# EAGLE design REV4 (EAGLE 9.2.0)
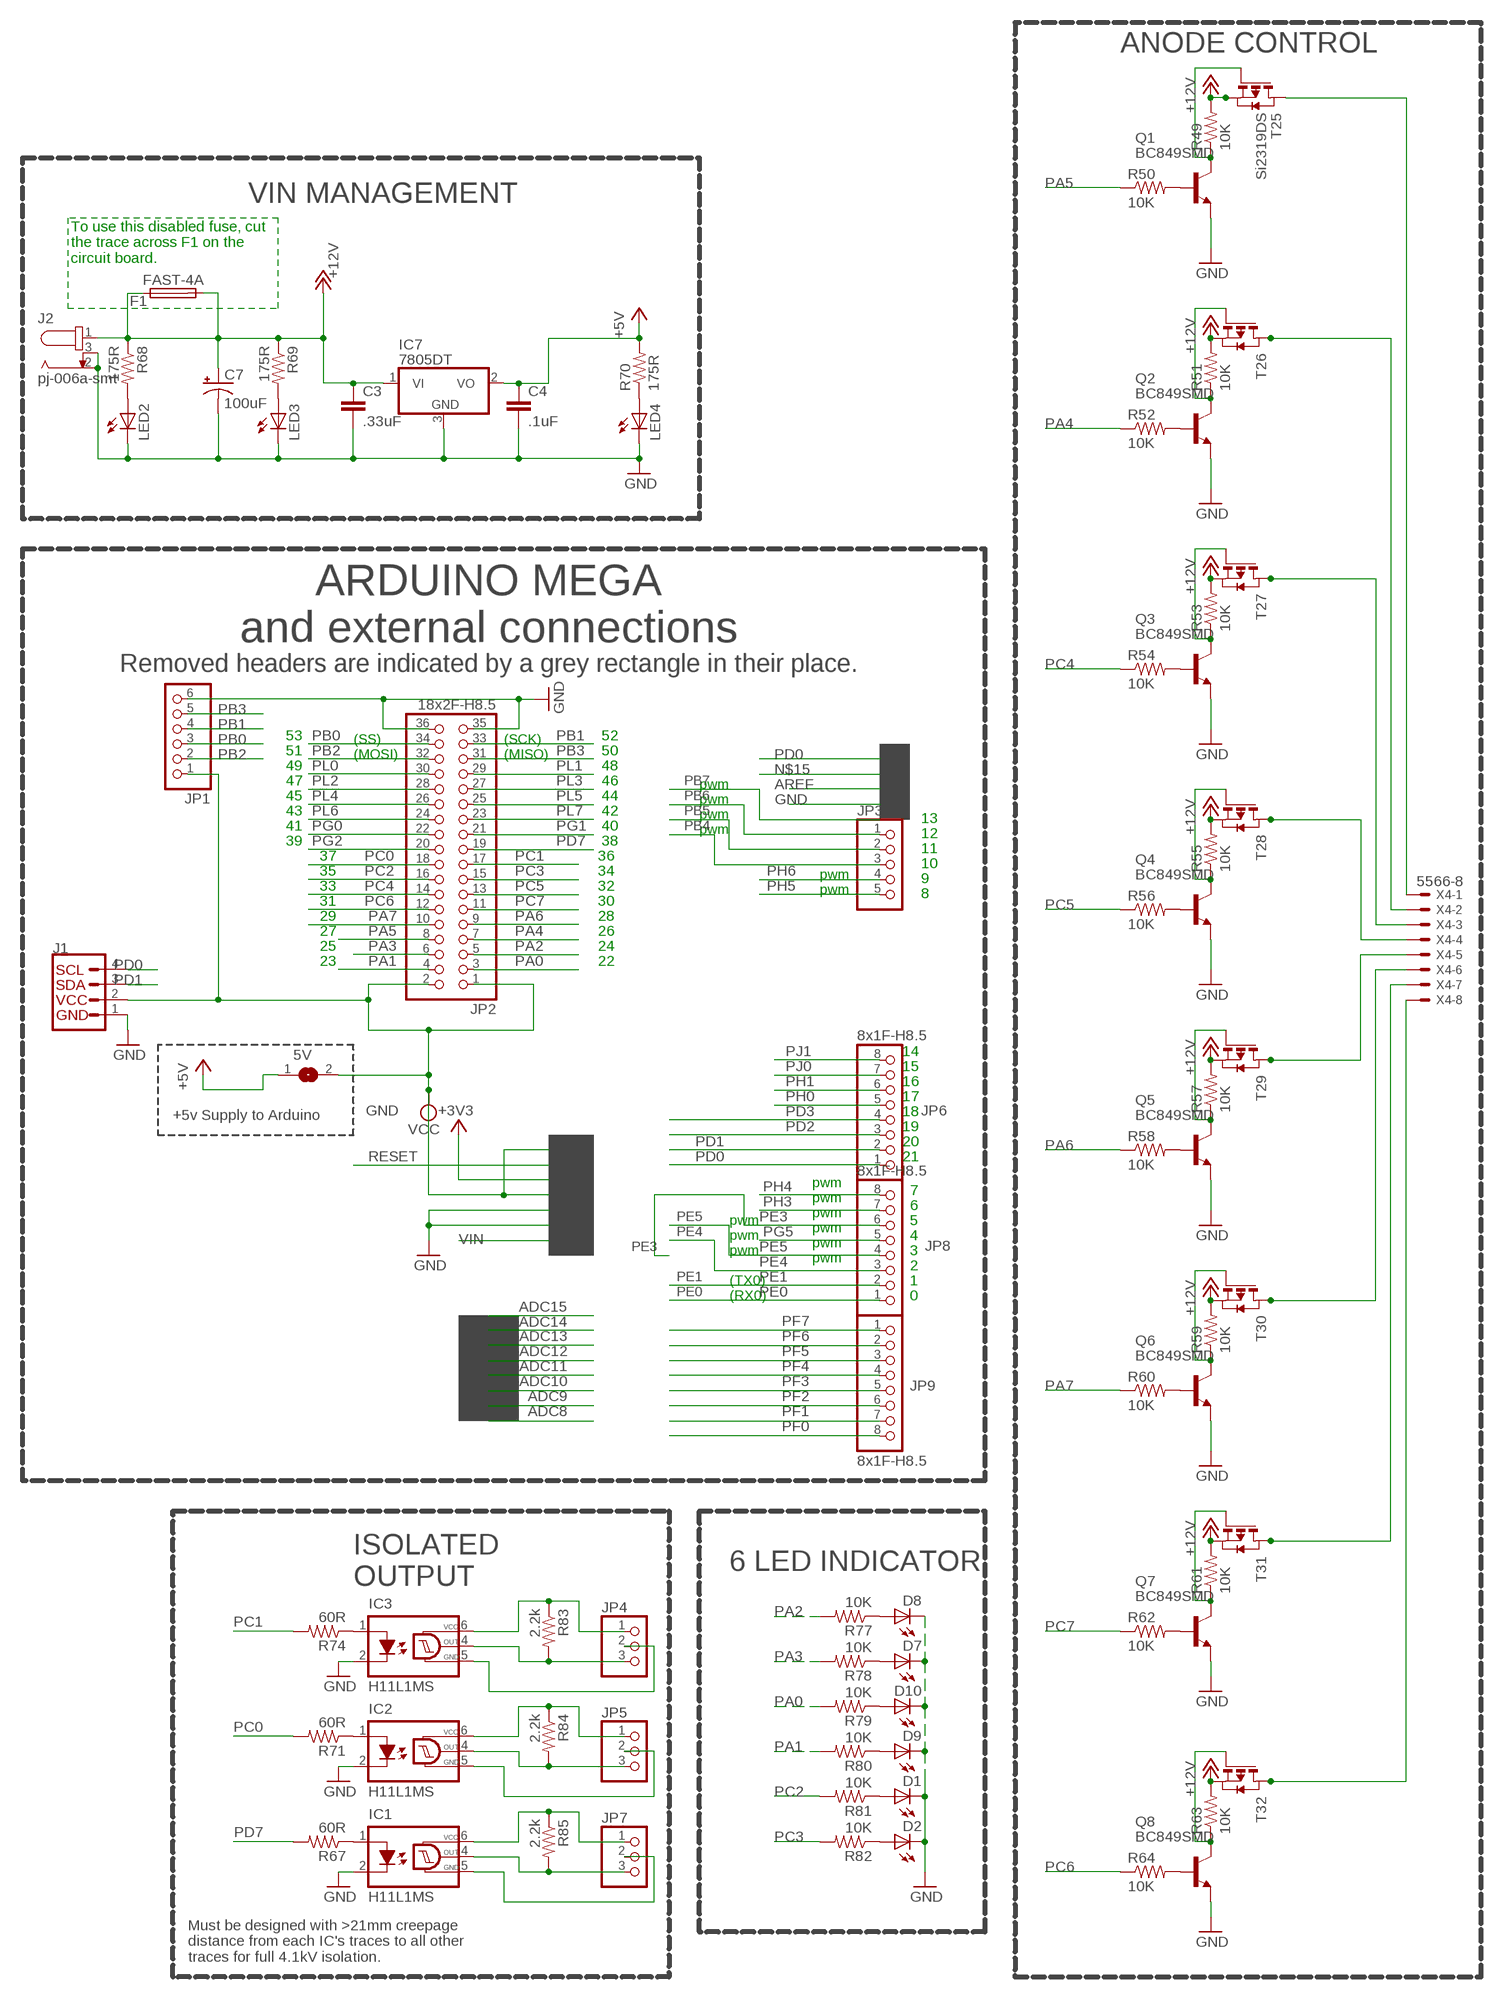
[diagram p0: schematic, sheet 1, part 1 of 2]
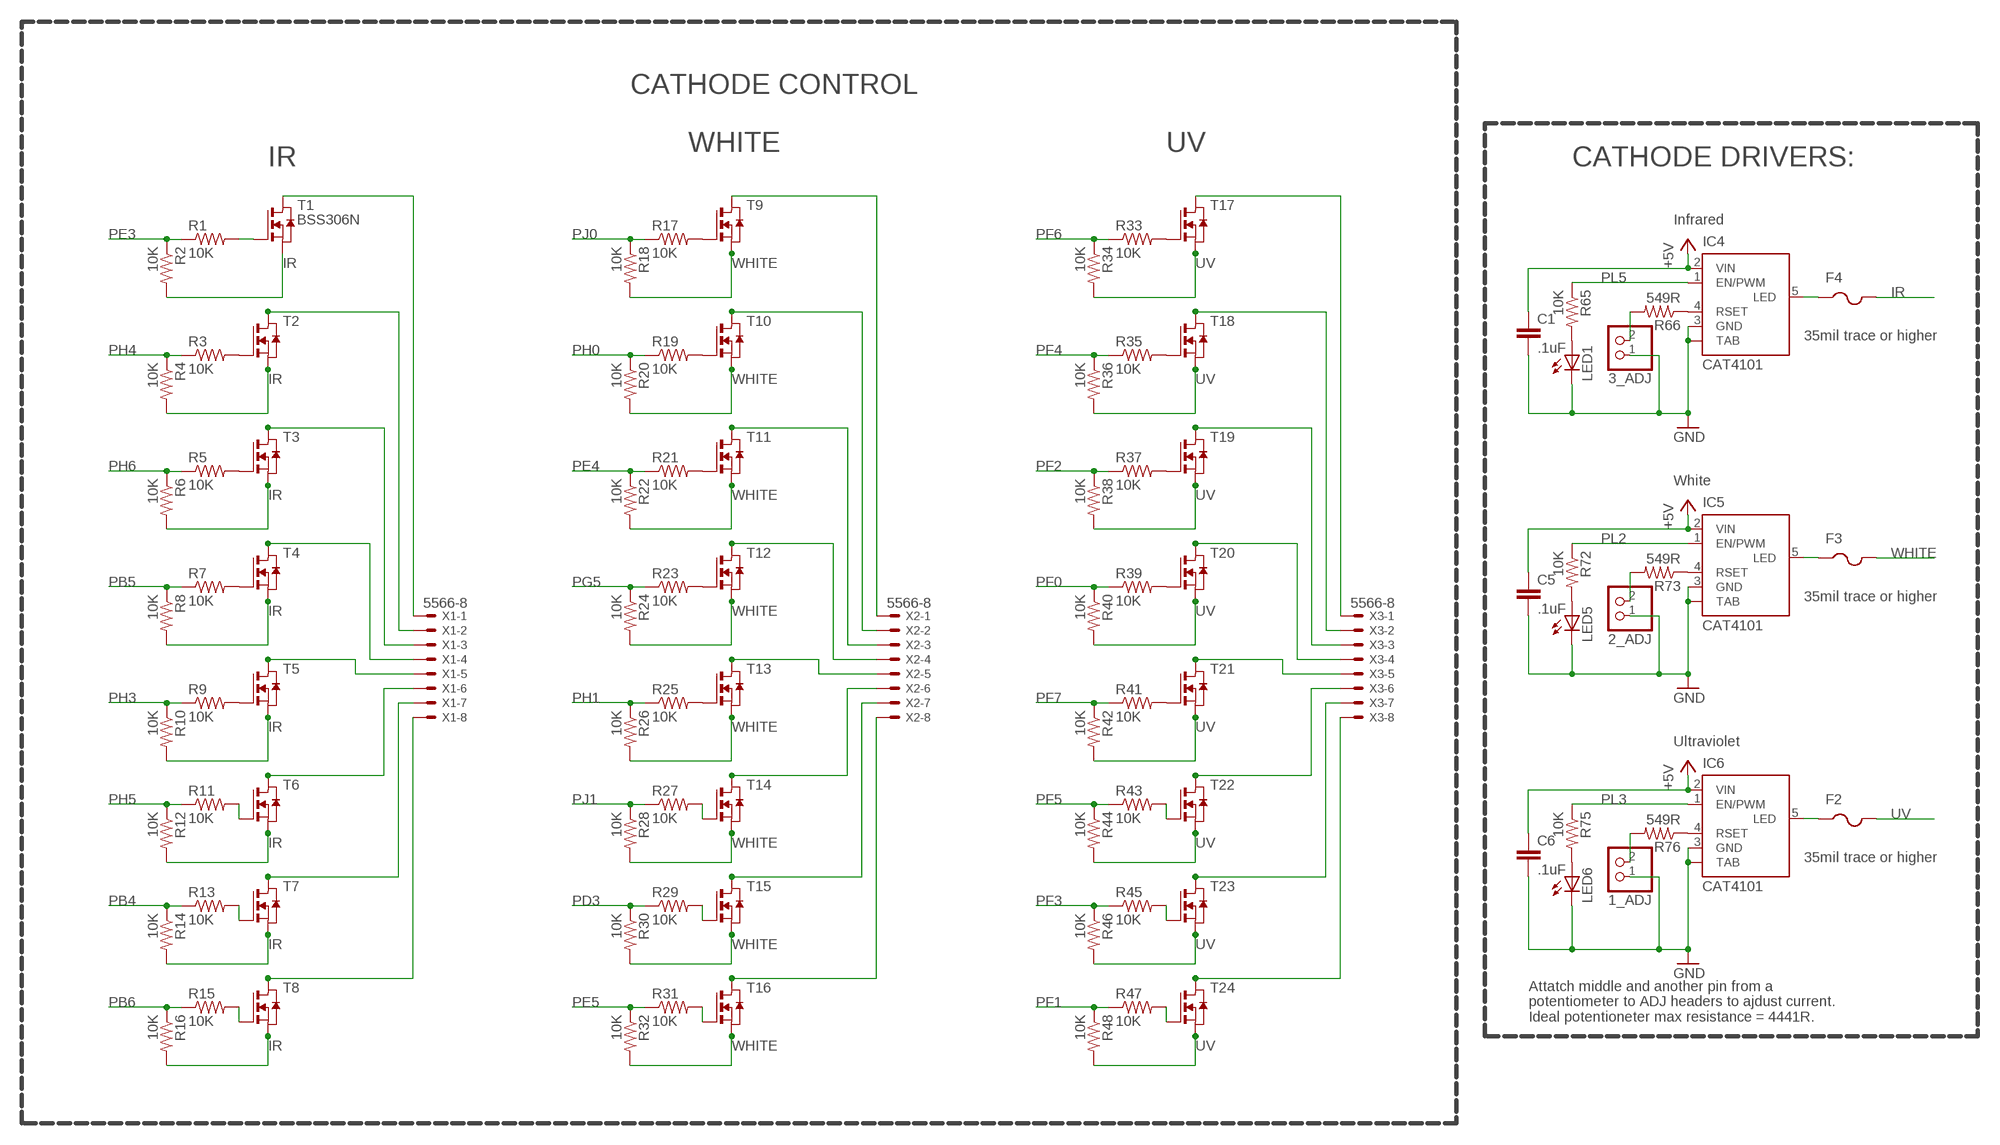
[diagram p1: schematic, sheet 1, part 2 of 2]

## Parts
1_ADJ  PINHD-1X2  [1X02]
2_ADJ  PINHD-1X2  [1X02]
3_ADJ  PINHD-1X2  [1X02]
5V  SJ  [SJ]
C1  .1uF  C  [C0805]
C3  .33uF  C  [C0805]
C4  .1uF  C  [C0805]
C5  .1uF  C  [C0805]
C6  .1uF  C  [C0805]
C7  100uF  CPOL-US153CLV-0807  [153CLV-0807]
D1  LEDSMT1206  [1206]
D2  LEDSMT1206  [1206]
D7  LEDSMT1206  [1206]
D8  LEDSMT1206  [1206]
D9  LEDSMT1206  [1206]
D10  LEDSMT1206  [1206]
F1  FAST-4A  FUSE_MF-SMDF050  [FUSE_MF-SMDF050]
F2  PTCFUSE-1812  [1812]
F3  PTCFUSE-1812  [1812]
F4  PTCFUSE-1812  [1812]
IC1  H11L1MS  [DIL6-SMD]
IC2  H11L1MS  [DIL6-SMD]
IC3  H11L1MS  [DIL6-SMD]
IC4  CAT4101  [TO263_5]
IC5  CAT4101  [TO263_5]
IC6  CAT4101  [TO263_5]
IC7  7805DT  [TO252]
J1  I2C_STANDARD  [1X04]
J2  pj-006a-smt  694106210102  [69410X210102]
JP1  PINHD-1X6  [1X06]
JP2  18x2F-H8.5  PINHD-2X18  [2X18]
JP3  PINHD-1X5  [1X05]
JP4  PINHD-1X3  [1X03]
JP5  PINHD-1X3  [1X03]
JP6  8x1F-H8.5  PINHD-1X8  [1X08]
JP7  PINHD-1X3  [1X03]
JP8  8x1F-H8.5  PINHD-1X8  [1X08]
JP9  8x1F-H8.5  PINHD-1X8  [1X08]
LED1  LEDSMT1206  [1206]
LED2  LEDSMT1206  [1206]
LED3  LEDSMT1206  [1206]
LED4  LEDSMT1206  [1206]
LED5  LEDSMT1206  [1206]
LED6  LEDSMT1206  [1206]
Q1  BC849SMD  [SOT23-BEC]
Q2  BC849SMD  [SOT23-BEC]
Q3  BC849SMD  [SOT23-BEC]
Q4  BC849SMD  [SOT23-BEC]
Q5  BC849SMD  [SOT23-BEC]
Q6  BC849SMD  [SOT23-BEC]
Q7  BC849SMD  [SOT23-BEC]
Q8  BC849SMD  [SOT23-BEC]
R1  10K  R-US_R0805  [R0805]
R2  10K  R-US_R0805  [R0805]
R3  10K  R-US_R0805  [R0805]
R4  10K  R-US_R0805  [R0805]
R5  10K  R-US_R0805  [R0805]
R6  10K  R-US_R0805  [R0805]
R7  10K  R-US_R0805  [R0805]
R8  10K  R-US_R0805  [R0805]
R9  10K  R-US_R0805  [R0805]
R10  10K  R-US_R0805  [R0805]
R11  10K  R-US_R0805  [R0805]
R12  10K  R-US_R0805  [R0805]
R13  10K  R-US_R0805  [R0805]
R14  10K  R-US_R0805  [R0805]
R15  10K  R-US_R0805  [R0805]
R16  10K  R-US_R0805  [R0805]
R17  10K  R-US_R0805  [R0805]
R18  10K  R-US_R0805  [R0805]
R19  10K  R-US_R0805  [R0805]
R20  10K  R-US_R0805  [R0805]
R21  10K  R-US_R0805  [R0805]
R22  10K  R-US_R0805  [R0805]
R23  10K  R-US_R0805  [R0805]
R24  10K  R-US_R0805  [R0805]
R25  10K  R-US_R0805  [R0805]
R26  10K  R-US_R0805  [R0805]
R27  10K  R-US_R0805  [R0805]
R28  10K  R-US_R0805  [R0805]
R29  10K  R-US_R0805  [R0805]
R30  10K  R-US_R0805  [R0805]
R31  10K  R-US_R0805  [R0805]
R32  10K  R-US_R0805  [R0805]
R33  10K  R-US_R0805  [R0805]
R34  10K  R-US_R0805  [R0805]
R35  10K  R-US_R0805  [R0805]
R36  10K  R-US_R0805  [R0805]
R37  10K  R-US_R0805  [R0805]
R38  10K  R-US_R0805  [R0805]
R39  10K  R-US_R0805  [R0805]
R40  10K  R-US_R0805  [R0805]
R41  10K  R-US_R0805  [R0805]
R42  10K  R-US_R0805  [R0805]
R43  10K  R-US_R0805  [R0805]
R44  10K  R-US_R0805  [R0805]
R45  10K  R-US_R0805  [R0805]
R46  10K  R-US_R0805  [R0805]
R47  10K  R-US_R0805  [R0805]
R48  10K  R-US_R0805  [R0805]
R49  10K  R-US_R0805  [R0805]
R50  10K  R-US_R0805  [R0805]
R51  10K  R-US_R0805  [R0805]
R52  10K  R-US_R0805  [R0805]
R53  10K  R-US_R0805  [R0805]
R54  10K  R-US_R0805  [R0805]
R55  10K  R-US_R0805  [R0805]
R56  10K  R-US_R0805  [R0805]
R57  10K  R-US_R0805  [R0805]
R58  10K  R-US_R0805  [R0805]
R59  10K  R-US_R0805  [R0805]
R60  10K  R-US_R0805  [R0805]
R61  10K  R-US_R0805  [R0805]
R62  10K  R-US_R0805  [R0805]
R63  10K  R-US_R0805  [R0805]
R64  10K  R-US_R0805  [R0805]
R65  10K  R-US_R0805  [R0805]
R66  549R  R-US_R0805  [R0805]
R67  60R  R-US_R0805  [R0805]
R68  175R  R-US_R0805  [R0805]
R69  175R  R-US_R0805  [R0805]
R70  175R  R-US_R0805  [R0805]
R71  60R  R-US_R0805  [R0805]
R72  10K  R-US_R0805  [R0805]
R73  549R  R-US_R0805  [R0805]
R74  60R  R-US_R0805  [R0805]
R75  10K  R-US_R0805  [R0805]
R76  549R  R-US_R0805  [R0805]
R77  10K  R-US_R0805  [R0805]
R78  10K  R-US_R0805  [R0805]
R79  10K  R-US_R0805  [R0805]
R80  10K  R-US_R0805  [R0805]
R81  10K  R-US_R0805  [R0805]
R82  10K  R-US_R0805  [R0805]
R83  2.2k  R-US_R0805  [R0805]
R84  2.2k  R-US_R0805  [R0805]
R85  2.2k  R-US_R0805  [R0805]
T1  BSS306N  NMOSSOT23  [SOT-23]
T2  NMOSSOT23  [SOT-23]
T3  NMOSSOT23  [SOT-23]
T4  NMOSSOT23  [SOT-23]
T5  NMOSSOT23  [SOT-23]
T6  NMOSSOT23  [SOT-23]
T7  NMOSSOT23  [SOT-23]
T8  NMOSSOT23  [SOT-23]
T9  NMOSSOT23  [SOT-23]
T10  NMOSSOT23  [SOT-23]
T11  NMOSSOT23  [SOT-23]
T12  NMOSSOT23  [SOT-23]
T13  NMOSSOT23  [SOT-23]
T14  NMOSSOT23  [SOT-23]
T15  NMOSSOT23  [SOT-23]
T16  NMOSSOT23  [SOT-23]
T17  NMOSSOT23  [SOT-23]
T18  NMOSSOT23  [SOT-23]
T19  NMOSSOT23  [SOT-23]
T20  NMOSSOT23  [SOT-23]
T21  NMOSSOT23  [SOT-23]
T22  NMOSSOT23  [SOT-23]
T23  NMOSSOT23  [SOT-23]
T24  NMOSSOT23  [SOT-23]
T25  Si2319DS  PMOSSOT23  [SOT-23]
T26  PMOSSOT23  [SOT-23]
T27  PMOSSOT23  [SOT-23]
T28  PMOSSOT23  [SOT-23]
T29  PMOSSOT23  [SOT-23]
T30  PMOSSOT23  [SOT-23]
T31  PMOSSOT23  [SOT-23]
T32  PMOSSOT23  [SOT-23]
X1  5566-8  [5566-8]
X2  5566-8  [5566-8]
X3  5566-8  [5566-8]
X4  5566-8  [5566-8]

## Nets
+5V [power usb]: 5V.1 C1.1 C4.1 C5.1 C6.1 IC4.2(VIN) IC5.2(VIN) IC6.2(VIN) IC7.2(VO) R70.2
+12V: C3.1 C7.+ F1.1 F1.2 IC7.1(VI) J2.1 R49.2 R51.2 R53.2 R55.2 R57.2 R59.2 R61.2 R63.2 R68.1 R69.1 T25.2(S) T26.2(S) T27.2(S) T28.2(S) T29.2(S) T30.2(S) T31.2(S) T32.2(S)
GND [gnd]: 1_ADJ.1 2_ADJ.1 3_ADJ.1 C1.2 C3.2 C4.2 C5.2 C6.2 C7.- D1.C D2.C D7.C D8.C D9.C D10.C IC1.2(C) IC2.2(C) IC3.2(C) IC4.3(GND) IC4.TAB IC5.3(GND) IC5.TAB IC6.3(GND) IC6.TAB IC7.3(GND) J1.1 J2.2 J2.3 JP1.6 JP2.35 JP2.36 LED1.C LED2.C LED3.C LED4.C LED5.C LED6.C Q1.E Q2.E Q3.E Q4.E Q5.E Q6.E Q7.E Q8.E
IR: F4.2 R2.2 R4.2 R6.2 R8.2 R10.2 R12.2 R14.2 R16.2 T1.2(S) T2.2(S) T3.2(S) T4.2(S) T5.2(S) T6.2(S) T7.2(S) T8.2(S)
N$1: LED4.A R70.1
N$2: Q2.C R51.1 T26.3(G)
N$3: T26.1(D) X4.2
N$4: 1_ADJ.2 R76.2
N$5: Q1.B R50.2
N$6: Q1.C R49.1 T25.3(G)
N$7: T25.1(D) X4.1
N$8: D8.A R77.1
N$9: 2_ADJ.2 R73.2
N$10: LED2.A R68.2
N$11: Q2.B R52.2
N$12: F2.1 IC6.5(LED)
N$13: Q3.C R53.1 T27.3(G)
N$14: D1.A R81.1
N$16: D7.A R78.1
N$17: T27.1(D) X4.3
N$18: D10.A R79.1
N$19: Q3.B R54.2
N$20: F3.1 IC5.5(LED)
N$21: Q4.C R55.1 T28.3(G)
N$22: F4.1 IC4.5(LED)
N$23: T28.1(D) X4.4
N$24: 3_ADJ.2 R66.2
N$25: Q4.B R56.2
N$26: IC4.4(RSET) R66.1
N$27: Q5.C R57.1 T29.3(G)
N$28: IC5.4(RSET) R73.1
N$29: T29.1(D) X4.5
N$30: D2.A R82.1
N$31: Q5.B R58.2
N$33: Q6.C R59.1 T30.3(G)
N$35: T30.1(D) X4.6
N$39: LED3.A R69.2
N$40: LED6.A R75.2
N$41: LED5.A R72.2
N$42: LED1.A R65.2
N$44: R1.2 T1.3(G)
N$45: D9.A R80.1
N$46: IC1.1(A) R67.1
N$47: IC2.1(A) R71.1
N$48: IC3.1(A) R74.1
N$67: Q6.B R60.2
N$78: T1.1(D) X1.1
N$80: R3.2 T2.3(G)
N$81: T2.1(D) X1.2
N$82: R5.2 T3.3(G)
N$83: T3.1(D) X1.3
N$84: R7.2 T4.3(G)
N$85: T4.1(D) X1.4
N$86: R9.2 T5.3(G)
N$87: T5.1(D) X1.5
N$88: R11.2 T6.3(G)
N$89: T6.1(D) X1.6
N$90: R13.2 T7.3(G)
N$91: T7.1(D) X1.7
N$92: R15.2 T8.3(G)
N$93: T8.1(D) X1.8
N$94: R17.2 T9.3(G)
N$95: T9.1(D) X2.1
N$96: R19.2 T10.3(G)
N$97: T10.1(D) X2.2
N$98: R21.2 T11.3(G)
N$99: T11.1(D) X2.3
N$100: R23.2 T12.3(G)
N$101: T12.1(D) X2.4
N$102: R25.2 T13.3(G)
N$103: T13.1(D) X2.5
N$104: R27.2 T14.3(G)
N$105: T14.1(D) X2.6
N$106: R29.2 T15.3(G)
N$107: T15.1(D) X2.7
N$108: R31.2 T16.3(G)
N$109: T16.1(D) X2.8
N$110: R33.2 T17.3(G)
N$111: T17.1(D) X3.1
N$112: R35.2 T18.3(G)
N$113: T18.1(D) X3.2
N$114: R37.2 T19.3(G)
N$115: T19.1(D) X3.3
N$116: R39.2 T20.3(G)
N$117: T20.1(D) X3.4
N$118: R41.2 T21.3(G)
N$119: T21.1(D) X3.5
N$120: R43.2 T22.3(G)
N$121: T22.1(D) X3.6
N$122: R45.2 T23.3(G)
N$123: T23.1(D) X3.7
N$124: R47.2 T24.3(G)
N$125: T24.1(D) X3.8
N$127: Q7.C R61.1 T31.3(G)
N$128: T31.1(D) X4.7
N$129: Q7.B R62.2
N$130: Q8.C R63.1 T32.3(G)
N$131: T32.1(D) X4.8
N$132: Q8.B R64.2
OK6_GND [Isolated]: IC1.5(GND) JP7.2
OK6_OUT [Isolated]: IC1.4(OUT) JP7.3 R85.2
OK6_VCC [Isolated]: IC1.6(VCC) JP7.1 R85.1
OK7_GND [Isolated]: IC2.5(GND) JP5.2
OK7_OUT [Isolated]: IC2.4(OUT) JP5.3 R84.2
OK7_VCC [Isolated]: IC2.6(VCC) JP5.1 R84.1
OK8_GND [Isolated]: IC3.5(GND) JP4.2
OK8_OUT [Isolated]: IC3.4(OUT) JP4.3 R83.2
OK8_VCC [Isolated]: IC3.6(VCC) JP4.1 R83.1
PA0: JP2.3 R79.2
PA1: JP2.4 R80.2
PA2: JP2.5 R77.2
PA3: JP2.6 R78.2
PA4: JP2.7 R52.1
PA5: JP2.8 R50.1
PA6: JP2.9 R58.1
PA7: JP2.10 R60.1
PB0: JP1.3 JP2.34
PB1: JP1.4 JP2.33
PB2: JP1.2 JP2.32
PB3: JP1.5 JP2.31
PB4: JP3.3 R13.1 R14.1
PB5: JP3.2 R7.1 R8.1
PB6: JP3.1 R15.1 R16.1
PC0: JP2.18 R71.2
PC1: JP2.17 R74.2
PC2: JP2.16 R81.2
PC3: JP2.15 R82.2
PC4: JP2.14 R54.1
PC5: JP2.13 R56.1
PC6: JP2.12 R64.1
PC7: JP2.11 R62.1
PD0: J1.4 JP6.1
PD1: J1.3 JP6.2
PD2: JP6.3
PD3: JP6.4 R29.1 R30.1
PD7: JP2.19 R67.2
PE0: JP8.1
PE1: JP8.2
PE3: JP8.6 R1.1 R2.1
PE4: JP8.3 R21.1 R22.1
PE5: JP8.4 R31.1 R32.1
PF0: JP9.8 R39.1 R40.1
PF1: JP9.7 R47.1 R48.1
PF2: JP9.6 R37.1 R38.1
PF3: JP9.5 R45.1 R46.1
PF4: JP9.4 R35.1 R36.1
PF5: JP9.3 R43.1 R44.1
PF6: JP9.2 R33.1 R34.1
PF7: JP9.1 R41.1 R42.1
PG0: JP2.22
PG1: JP2.21
PG2: JP2.20
PG5: JP8.5 R23.1 R24.1
PH0: JP6.5 R19.1 R20.1
PH1: JP6.6 R25.1 R26.1
PH3: JP8.7 R9.1 R10.1
PH4: JP8.8 R3.1 R4.1
PH5: JP3.5 R11.1 R12.1
PH6: JP3.4 R5.1 R6.1
PJ0: JP6.7 R17.1 R18.1
PJ1: JP6.8 R27.1 R28.1
PL0: JP2.30
PL1: JP2.29
PL2: IC5.1(EN/PWM) JP2.28 R72.1
PL3: IC6.1(EN/PWM) JP2.27 R75.1
PL4: JP2.26
PL5: IC4.1(EN/PWM) JP2.25 R65.1
PL6: JP2.24
PL7: JP2.23
UV: F2.2 R34.2 R36.2 R38.2 R40.2 R42.2 R44.2 R46.2 R48.2 T17.2(S) T18.2(S) T19.2(S) T20.2(S) T21.2(S) T22.2(S) T23.2(S) T24.2(S)
UV_SET: IC6.4(RSET) R76.1
VCC: 5V.2 J1.2 JP1.1 JP2.1 JP2.2
WHITE: F3.2 R18.2 R20.2 R22.2 R24.2 R26.2 R28.2 R30.2 R32.2 T9.2(S) T10.2(S) T11.2(S) T12.2(S) T13.2(S) T14.2(S) T15.2(S) T16.2(S)

## Notes on the sheet
- ANODE CONTROL
- VIN MANAGEMENT
- To use this disabled fuse, cut 
  the trace across F1 on the 
  circuit board.
- CATHODE CONTROL
- ARDUINO MEGA
  and external connections
- WHITE | UV
- IR | CATHODE DRIVERS:
- Removed headers are indicated by a grey rectangle in their place.
- Infrared
- 53 | (SS) | (SCK) | 52
- 51 | (MOSI) | (MISO) | 50
- 49 | 48
- 47 | 46 | pwm
- 45 | 44 | pwm | 35mil trace or higher
- 43 | 42 | pwm
- 13
- 41 | 40 | pwm
- 12
- 39 | 38
- 11
- 37 | 36
- 10
- 35 | 34 | pwm
- 9
- 33 | 32 | pwm
- 8
- 31 | 30
- 29 | 28
- 27 | 26
- 25 | 24 | White
- 23 | 22
- 14
- 15 | 35mil trace or higher
- 16
- GND | 17
- +5v Supply to Arduino | 18
- 19
- 20
- 21
- pwm
- 7
- pwm
- 6
- pwm
- pwm | 5 | Ultraviolet
- pwm
- pwm | 4
- pwm
- pwm | 3
- pwm
- 2
- (TX0) | 1
- (RX0) | 0
- 35mil trace or higher
- Attatch middle and another pin from a
  potentiometer to ADJ headers to ajdust current. 
  Ideal potentioneter max resistance = 4441R.
- 6 LED INDICATOR
- ISOLATED
  OUTPUT
- Must be designed with >21mm creepage
  distance from each IC's traces to all other
  traces for full 4.1kV isolation.

## Library data of the parts
1_ADJ 2_ADJ 3_ADJ = pinhead:PINHD-1X2: PIN HEADER
5V = jumper:SJ: SMD solder JUMPER
C1 C3-C6 = eagle-ltspice:C: CAPACITOR, European symbol; SPICEMODEL: NONE; SPICEPREFIX: C
C7 = adafruit:CPOL-US: POLARIZED CAPACITOR, American symbol
D1 D2 D7-D10 LED1-LED6 = adafruit:LED: LED OSRAM: - CHIPLED LG R971, LG N971, LY N971, LG Q971, LY Q971, LO R971, LY R971 LH N974, LH R974 LS Q976, LO Q976, LY Q976 LO Q996 - Hyper CHIPLED LW Q18S LB Q993, LB Q99A, LB R99A - SideLED LS A670, LO A670, LY A670, LG A670, LP A670 LB A673, LV A673, LT A673, LW A673 LH A674 LY A675 LS A676, LA A676, LO A676, LY A676, LW A676 LS A679, LY A679, LG A679 - Hyper Micro SIDELED® LS Y876, LA Y876, LO Y876, LY Y876 LT Y87S - SmartLED LW L88C, LW L88S LB L89C, LB L89S, LG L890 LS L89K, LO L89K, LY L89K LS L896, LA L896, LO L896, LY L896 - TOPLED LS T670, LO T670, LY T670, LG T670, LP T670 LSG T670, LSP T670, LSY T670, LOP T670, LYG T670 LG T671, LOG T671, LSG T671 LB T673, LV T673, LT T673, LW T673 LH T674 LS T676, LA T676, LO T676, LY T676, LB T676, LH T676, LSB T676, LW T676 LB T67C, LV T67C, LT T67C, LS T67K, LO T67K, LY T67K, LW E67C LS E67B, LA E67B, LO E67B, LY E67B, LB E67C, LV E67C, LT E67C LW T67C LS T679, LY T679, LG T679 LS T770, LO T770, LY T770, LG T770, LP T770 LB T773, LV T773, LT T773, LW T773 LH T774 LS E675, LA E675, LY E675, LS T675 LS T776, LA T776, LO T776, LY T776, LB T776 LHGB T686 LT T68C, LB T68C - Hyper Mini TOPLED® LB M676 - Mini TOPLED Santana® LG M470 LS M47K, LO M47K, LY M47K Source: http://www.osram.convergy.de/
F1 = REV4:FUSE_MF-SMDF: MF-SMDF Series - PRC Resettable Fuses Source: http://www.farnell.com/datasheets/716597.pdf
F2-F4 = adafruit:PTCFUSE: PTC fuses, resettable thermistors
IC1-IC3 = optocoupler:H11L*M: 6-Pin DIP Optocoupler Source: http://www.fairchildsemi.com/ds/H1/H11L2-M.pdf; OC_FARNELL: unknown; OC_NEWARK: unknown
IC4-IC6 = on-semiconductor:CAT4101: 1A Constant-Current LED Driver with PWM Dimming Source: ON Semiconductor .. 4101.pdf; MPN: CAT4101TV-T75; OC_FARNELL: 1718452; OC_NEWARK: 08R5264
IC7 = adafruit:78*: Positive VOLTAGE REGULATOR Added bigger pads to the TO-92 package
J1 = SparkFun-Connectors:I2C_STANDARD: SparkFun I2C Standard Pinout Header SparkFun has standardized on a pinout for all I2C based sensor breakouts. This pinout allows I2C boards to be plugged directly into the headers on Arduino Uno compatible boards, and to be daisy chained easily. Example SparkFun Products: SparkFun Atmospheric Sensor Breakout - BME280 <https://www.sparkfun.com/products/13676> SparkFun Altitude/Pressure Sensor Breakout - MPL3115A2 <https://www.sparkfun.com/products/11084> SparkFun TOF Range Finder Sensor - VL6180 <https://www.sparkfun.com/products/12785>
J2 = Wurth_Elektronik_Electromechanic_DC_Power_Jack_Connectors_rev18b:694106210102: DC Power Jack Connector Vertical SMT Ø5.5 w.3 Solder Pads WR-DC <http://katalog.we-online.de/media/images/v2/WR-DC_6941xx210102_4C.jpg> Details see: http://katalog.we-online.de/em/datasheet/6941xx210102.pdf Created 2017-07-25, Yingchun,Shan 2017 (C) Wurth Elektronik
JP1 = pinhead:PINHD-1X6: PIN HEADER
JP2 = SmartPrj:PINHD-2X18: PIN HEADER
JP3 = pinhead:PINHD-1X5: PIN HEADER
JP4 JP5 JP7 = pinhead:PINHD-1X3: PIN HEADER
JP6 JP8 JP9 = SmartPrj:PINHD-1X8: PIN HEADER
Q1-Q8 = transistor-npn:BC849*: NPN Transistor
R1-R85 = adafruit:R-US_: RESISTOR, American symbol
T1-T24 = zetex:NMOSSOT23: MOS FET; OC_FARNELL: unknown; OC_NEWARK: unknown
T25-T32 = zetex:PMOSSOT23: MOS FET; OC_FARNELL: unknown; OC_NEWARK: unknown
X1-X4 = con-molex:5566-8: Mini FIT connector 8 pol Source: http://www.molex.com; MF: MOLEX; OC_FARNELL: unknown; OC_NEWARK: unknown

## Net classes
1 power: width 0.61 mm, drill 0.406 mm, clearance 0.203 mm
2 gnd: width 0.305 mm, drill 0.406 mm, clearance 0.203 mm
3 power usb: width 0.508 mm, drill 0.406 mm, clearance 0.203 mm
4 Isolated: clearance 0.279 mm

## Board
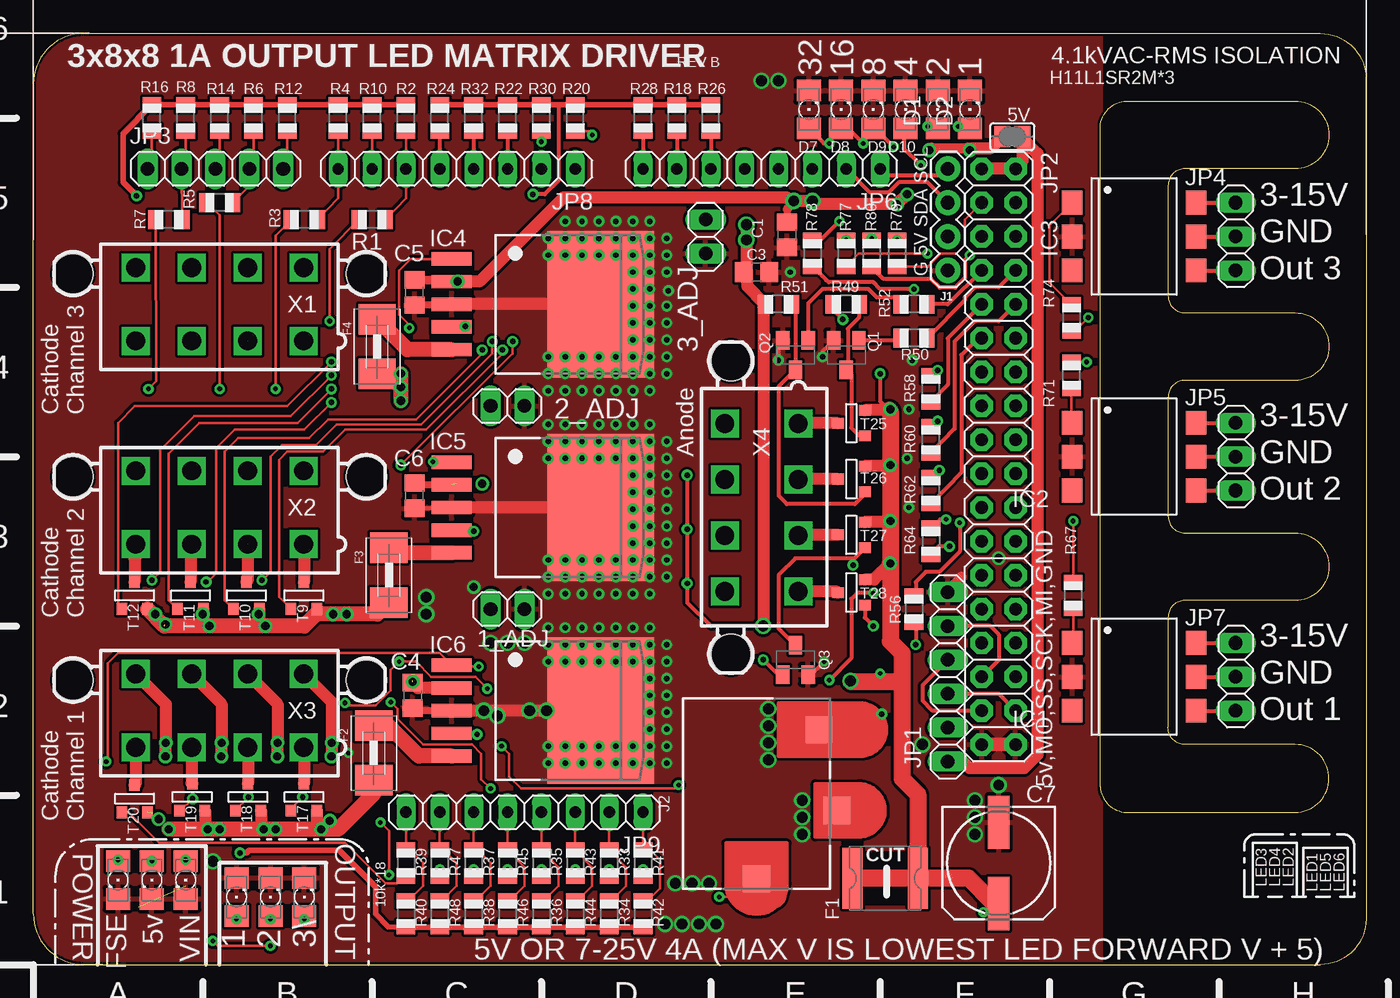
[diagram p2: board, top side]
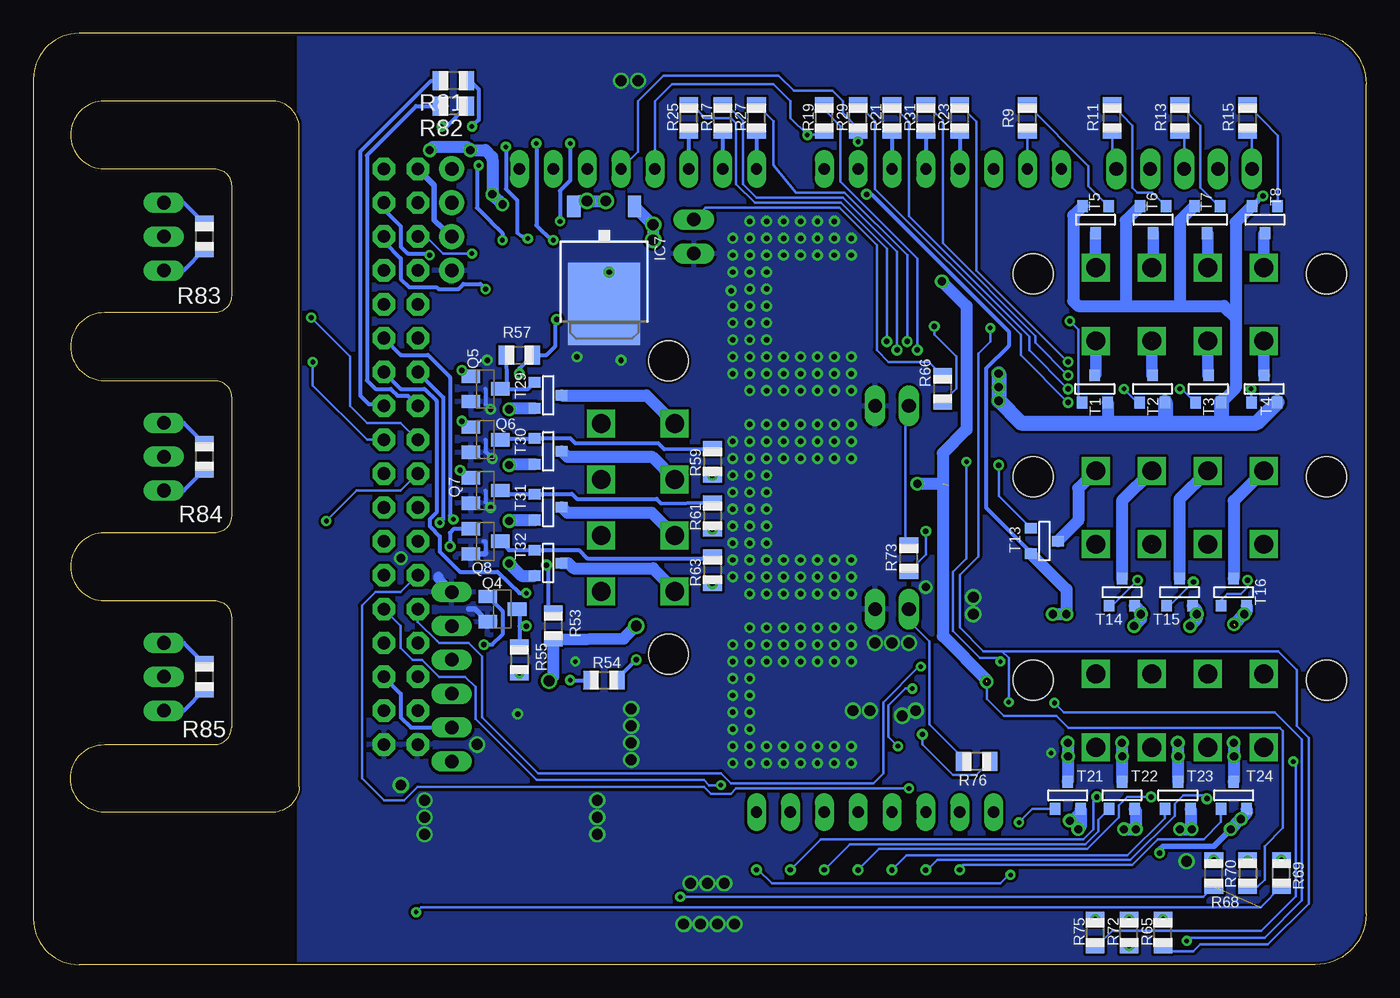
[diagram p3: board, bottom side, seen from below]

Size 99.95 x 69.85 mm. Coordinates in mm from the lower left corner, seen from the top.
Outline: 3.81,69.85 96.52,69.85 arc-90 99.95,66.42 99.95,3.43 arc-90 96.52,0 3.81,0 arc-90 0,3.81 0,66.04 arc-90 3.81,69.85
Outline: 80.01,13.34 80.01,62.87 arc-90 82.17,64.77 94.61,64.77 arc-90 97.16,62.23 arc-90 94.61,59.69 86.36,59.69 arc90 85.09,58.42 85.09,50.16 arc90 86.36,48.9 94.61,48.9 arc-90 97.16,46.35 arc-90 94.61,43.81 86.36,43.81 arc90 85.09,42.55 85.09,33.66 arc90 86.36,32.38 94.61,32.38 arc-90 97.16,29.84 arc-90 94.61,27.3 86.36,27.3 arc90 85.09,26.04 85.09,17.78 arc90 86.36,16.51 94.61,16.51 arc-90 97.16,13.97 arc-90 94.61,11.43 82.17,11.43 arc-90 80.01,13.34
Copper layers (1*16): Top 0.035mm / dielectric 1.5mm / Bottom 0.035mm
Design rules "default *": minimum track width 6mil, minimum drill 0.35mm, track to track 6mil, track to pad 6mil, pad to pad 6mil, via to via 6mil, smd to smd 6mil, copper to edge 0.2mm, drill to drill 6mil, minimum pad ring 10mil, minimum via ring 8mil, stop-mask expansion 4mil, vias tented up to drill 35mil, thermal gap 10mil
tRestrict: area 62.4,4.4 to 65.4,8.5

### Footprints (pad centres in the part's own frame; a part is rotated, then mirrored left to right if it is on the bottom)
1X02 = drill 1.016 long: 1 -1.27,0; 2 1.27,0
SJ = smd 1.168 x 1.6: 1 -0.762,0; 2 0.762,0
C0805 = smd 1.3 x 1.5: 1 -0.95,0; 2 0.95,0
153CLV-0807 = smd 4 x 1.6: + 3.05,0; - -3.05,0
1206 = smd 1.6 x 1.803: A -1.422,0; C 1.422,0
FUSE_MF-SMDF050 = smd 1.5 x 4.6: 1 -2.45,0; 2 2.45,0
1812 = smd 2.286 x 2.794: 1 -2.046,0; 2 2.046,0
DIL6-SMD = smd 1.78 x 1.52: 1 -2.54,-4.645; 2 0,-4.645; 3 2.54,-4.645; 4 2.54,4.645; 5 0,4.645; 6 -2.54,4.645
TO263_5 = smd 1 x 3: 1 -3.4,-8; 2 -1.7,-8; 3 0,-8; 4 1.7,-8; 5 3.4,-8 | smd 11 x 8: TAB 0,3.175
TO252 = smd 1 x 1.6: 1 -2.28,-4.8; 2 2.28,-4.8 | smd 5.4 x 6.2: 3 0,2.5
1X04 = drill 1.016 pad 1.88: 1 0,0; 2 2.54,0; 3 5.08,0; 4 7.62,0
69410X210102 = smd 2 x 2: 1 -6.365,0; 2 -1.25,-6.025; 3 4.8,-4.7
1X06 = drill 1.016 long: 1 -6.35,0; 2 -3.81,0; 3 -1.27,0; 4 1.27,0; 5 3.81,0; 6 6.35,0
2X18 = drill 0.95 pad 1.676 octagon: 1 -21.59,-1.27; 2 -21.59,1.27; 3 -19.05,-1.27; 4 -19.05,1.27; 5 -16.51,-1.27; 6 -16.51,1.27; 7 -13.97,-1.27; 8 -13.97,1.27; 9 -11.43,-1.27; 10 -11.43,1.27; 11 -8.89,-1.27; 12 -8.89,1.27; 13 -6.35,-1.27; 14 -6.35,1.27; 15 -3.81,-1.27; 16 -3.81,1.27; 17 -1.27,-1.27; 18 -1.27,1.27; 19 1.27,-1.27; 20 1.27,1.27; 21 3.81,-1.27; 22 3.81,1.27; 23 6.35,-1.27; 24 6.35,1.27; 25 8.89,-1.27; 26 8.89,1.27; 27 11.43,-1.27; 28 11.43,1.27; 29 13.97,-1.27; 30 13.97,1.27; 31 16.51,-1.27; 32 16.51,1.27; 33 19.05,-1.27; 34 19.05,1.27; 35 21.59,-1.27; 36 21.59,1.27
1X05 = drill 1.016 long: 1 -5.08,0; 2 -2.54,0; 3 0,0; 4 2.54,0; 5 5.08,0
1X03 = drill 1.016 long: 1 -2.54,0; 2 0,0; 3 2.54,0
1X08 = drill 0.85 pad 1.422 long: 1 -8.89,0; 2 -6.35,0; 3 -3.81,0; 4 -1.27,0; 5 1.27,0; 6 3.81,0; 7 6.35,0; 8 8.89,0
SOT23-BEC = smd 1 x 1.4: B -0.95,-1.1; C 0,1.1; E 0.95,-1.1
R0805 = smd 1.1 x 1.4: 1 -1,0; 2 1,0
SOT-23 = smd 0.787 x 0.889: 1 0.025,-1.016; 2 -0.94,1.016; 3 0.991,1.016
5566-8 = drill 1.4 square: 1 6.3,-2.75; 2 2.1,-2.75; 3 -2.1,-2.75; 4 -6.3,-2.75; 5 6.3,2.75; 6 2.1,2.75; 7 -2.1,2.75; 8 -6.3,2.75 | hole 3: 11,2.29; -11,2.29

### Placement (x,y rotation side)
1_ADJ  35.56,26.67 180 top
2_ADJ  35.56,41.91 180 top
3_ADJ  50.42,54.61 90 top
5V  73.41,62.1 0 top
C1  56.52,54.74 270 top
C3  54.23,51.94 0 top
C4  28.45,20.19 270 top
C5  28.57,50.42 270 top
C6  28.57,35.18 270 top
C7  72.39,7.62 270 top
D1  67.82,64.14 90 top
D2  70.23,64.14 90 top
D7  58.17,64.14 90 top
D8  60.58,64.14 90 top
D9  62.99,64.14 90 top
D10  65.41,64.14 90 top
F1  63.88,6.48 0 top
F2  25.53,15.88 270 top
F3  26.67,29.21 270 top
F4  25.78,46.35 270 top
IC1  82.55,21.59 270 top
IC2  82.55,38.1 270 top
IC3  82.55,54.61 270 top
IC4  39.37,49.53 270 top
IC5  39.37,34.29 270 top
IC6  39.37,19.05 270 top
IC7  57.15,52.07 180 bottom
J1  68.58,52.07 90 top
J2  54.23,12.83 90 top
JP1  68.58,21.59 90 top
JP2  72.39,38.1 270 top
JP3  13.65,59.69 0 top
JP4  90.17,54.61 270 top
JP5  90.17,38.1 270 top
JP6  54.61,59.69 180 top
JP7  90.17,21.59 270 top
JP8  31.75,59.69 180 top
JP9  36.83,11.43 180 top
LED1  15.24,5.08 90 top
LED2  11.43,6.35 270 top
LED3  6.35,6.35 270 top
LED4  8.89,6.35 270 top
LED5  17.78,5.08 90 top
LED6  20.32,5.08 90 top
Q1  60.96,45.72 180 top
Q2  57.15,45.72 180 top
Q3  57.15,22.86 0 top
Q4  64.77,26.67 270 bottom
Q5  66.04,43.18 270 bottom
Q6  66.04,39.37 270 bottom
Q7  66.04,35.56 270 bottom
Q8  66.04,31.75 270 bottom
R1  25.4,55.88 180 top
R2  27.94,63.5 90 top
R3  20.32,55.88 180 top
R4  22.86,63.5 90 top
R5  13.97,57.15 180 top
R6  16.51,63.5 90 top
R7  10.16,55.88 180 top
R8  11.43,63.5 90 top
R9  25.4,63.5 90 bottom
R10  25.4,63.5 90 top
R11  19.05,63.5 90 bottom
R12  19.05,63.5 90 top
R13  13.97,63.5 90 bottom
R14  13.97,63.5 90 top
R15  8.89,63.5 90 bottom
R16  8.89,63.5 90 top
R17  48.26,63.5 90 bottom
R18  48.26,63.5 90 top
R19  40.64,63.5 90 bottom
R20  40.64,63.5 90 top
R21  35.56,63.5 90 bottom
R22  35.56,63.5 90 top
R23  30.48,63.5 90 bottom
R24  30.48,63.5 90 top
R25  50.8,63.5 90 bottom
R26  50.8,63.5 90 top
R27  45.72,63.5 90 bottom
R28  45.72,63.5 90 top
R29  38.1,63.5 90 bottom
R30  38.1,63.5 90 top
R31  33.02,63.5 90 bottom
R32  33.02,63.5 90 top
R33  43.18,7.62 270 top
R34  43.18,3.81 270 top
R35  38.1,7.62 270 top
R36  38.1,3.81 270 top
R37  33.02,7.62 270 top
R38  33.02,3.81 270 top
R39  27.94,7.62 270 top
R40  27.94,3.81 270 top
R41  45.72,7.62 270 top
R42  45.72,3.81 270 top
R43  40.64,7.62 270 top
R44  40.64,3.81 270 top
R45  35.56,7.62 270 top
R46  35.56,3.81 270 top
R47  30.48,7.62 270 top
R48  30.48,3.81 270 top
R49  60.96,49.53 180 top
R50  66.04,46.99 180 top
R51  55.88,49.53 180 top
R52  66.04,49.53 180 top
R53  60.96,25.4 270 bottom
R54  57.15,21.34 0 bottom
R55  63.5,22.86 270 bottom
R56  66.04,26.67 270 top
R57  63.5,45.72 0 bottom
R58  67.31,43.18 90 top
R59  49.02,37.72 270 bottom
R60  67.31,39.37 90 top
R61  49.02,33.66 270 bottom
R62  67.31,35.56 90 top
R63  49.02,29.59 270 bottom
R64  67.31,31.75 270 top
R65  15.24,2.41 90 bottom
R66  31.75,43.18 90 bottom
R67  77.98,27.69 90 top
R68  11.43,6.86 90 bottom
R69  6.35,6.86 90 bottom
R70  8.89,6.86 270 bottom
R71  77.85,44.2 90 top
R72  17.78,2.41 90 bottom
R73  34.29,30.48 90 bottom
R74  77.85,48.51 270 top
R75  20.32,2.41 90 bottom
R76  29.21,15.24 180 bottom
R77  60.96,53.34 270 top
R78  58.42,53.34 270 top
R79  64.77,53.34 270 top
R80  62.87,53.34 270 top
R81  68.45,66.29 180 bottom
R82  68.45,64.39 180 bottom
R83  87.12,54.61 270 bottom
R84  87.12,38.1 270 bottom
R85  87.12,21.59 270 bottom
T1  20.32,43.18 180 bottom
T2  16,43.18 180 bottom
T3  11.81,43.18 180 bottom
T4  7.62,43.18 180 bottom
T5  20.32,55.88 0 bottom
T6  16,55.88 0 bottom
T7  11.94,55.88 0 bottom
T8  7.62,55.88 0 bottom
T9  20.32,27.69 180 top
T10  16,27.69 180 top
T11  11.81,27.69 180 top
T12  7.62,27.69 180 top
T13  24.13,31.75 90 bottom
T14  18.29,27.94 180 bottom
T15  13.97,27.94 180 bottom
T16  9.91,27.94 180 bottom
T17  20.32,12.57 180 top
T18  16.13,12.57 180 top
T19  11.94,12.57 180 top
T20  7.62,12.45 180 top
T21  22.35,12.7 180 bottom
T22  18.29,12.7 180 bottom
T23  14.1,12.7 180 bottom
T24  9.91,12.7 180 bottom
T25  61.34,40.64 270 top
T26  61.34,36.45 270 top
T27  61.34,32.26 270 top
T28  61.34,27.94 270 top
T29  61.34,42.67 90 bottom
T30  61.34,38.48 90 bottom
T31  61.34,34.29 90 bottom
T32  61.34,30.1 90 bottom
X1  13.97,49.53 0 top
X2  13.97,34.29 0 top
X3  13.97,19.05 0 top
X4  54.61,34.29 90 top

### Tracks (layer width: path | path; a pad name or v marks a point on that pad's centre or on a via)
+5V  (via drill 0.61, 0.81)  (2 unrouted)
  Top 0.305: 74.17,62.1 5V.1
  Top 0.406: IC4.2 28.71,51.23
  Top 0.508: C6.1 28.71,35.99 IC5.2 | v28.45,21.21 C4.1 | C5.1 31.23,51.37 IC4.2 | v57.02,57.28 56.52,56.77 C1.1
  Top 0.61: v57.02,57.28 57.02,57.15 56.52,56.64
  Top 0.762: 70.1,61.21 67.31,61.21
  Top 0.889: v31.81,51.24 31.8,51.23 IC4.2 33.45,51.23 39.75,57.53 56.52,57.53 56.77,57.28 v57.02,57.28 v58.42,57.28 58.67,57.02 v64.77,57.02 v65.53,57.78 | v33.66,36.07 33.58,35.99 | 28.91,20.75 v28.45,21.21 | 5V.1 71.75,61.21 70.36,61.21 v70.23,61.09 70.1,61.21 | 67.31,61.21 v67.18,61.09 | C4.1 28.84,20.75 IC6.2
  Bottom 0.203: R70.2 8.11,5.86 7.62,6.35 7.62,8.89 6.24,10.27 6.24,17.53 6.49,17.77 22.34,17.77 23.24,18.67 27.18,18.67 28.45,19.94 28.45,21.34
  Bottom 0.889: v31.81,51.24 29.97,49.4 29.97,40.13 31.75,38.35 31.75,36.07 | 31.75,36.07 31.75,24.64 28.45,21.34 | v33.66,36.07 31.75,36.07 | v64.77,57.02 v65.53,57.78 65.52,57.8 65.52,60.37 65.53,60.38 65.53,60.58 66.04,61.09 v67.18,61.09 67.44,61.34 69.98,61.34 v70.23,61.09 | v57.02,57.28 59.02,57.28 IC7.2
+12V  (via drill 0.33, 0.35, 0.41, 0.61, 0.81)  (2 unrouted)
  Top 0.203: 53.34,5.08 v51.44,5.08 | C7.+ 71.88,4.57 v71.25,3.94
  Top 0.305: R51.2 54.77,49.37 | v63.5,44.32 63.5,42.27 64.19,41.58 | R59.2 R61.2 R63.2 49.02,27.18 50.8,25.4 v54.74,25.4 | R49.2 60.2,49.34 60.2,48.9 v60.71,48.39 | v63.5,21.84 63.5,21.21 | v71.25,3.94 71.88,4.57 C7.+ | 72.42,4.57 C7.+ | C7.+ | 53.34,5.08 54.23,5.08 J2.1
  Top 0.889: T28.2 63.04,28.88 v64.26,30.1 | T25.2 64.19,41.58 v64.26,41.66 | T26.2 64.19,37.39 v64.26,37.47 | T27.2 64.19,33.2 v64.26,33.27 | v54.74,25.4 54.74,49.34 54.77,49.37 | R51.2 53.53,50.93 53.53,52 53.47,52.07 | 53.47,52.07 v53.47,54.36 v53.47,55.5 | C3.1 53.41,52.07 53.47,52.07
  Top 1.143: v64.26,33.27 v64.26,30.1
  Top 1.27: 65.15,21.21 65.15,23.37 64.26,24.26 v64.26,30.1 v64.26,37.47 64.26,41.5 64.19,41.58 | 65.15,21.21 65.15,13.97 66.33,12.79 F1.2 | v61.28,21.27 61.34,21.21 63.5,21.21 65.15,21.21 | F1.2 70.14,6.48 72.05,4.57 C7.+ | F1.2 F1.1
  Top 2.032: 55.48,5.21 J2.1
  Bottom 0.203: R68.1 12.21,5.08 v51.44,5.08 | v71.25,3.94 70.87,4.32 7.89,4.32 R69.1
  Bottom 0.305: v71.25,3.94 71.12,4.06 | v60.71,48.39 60.83,48.26 60.83,46.35 61.47,45.72 R57.2 63.5,44.72 v63.5,44.32
  Bottom 0.889: T32.2 63.32,29.16 v64.26,30.1 | T30.2 64.19,37.54 v64.26,37.47 | T31.2 64.19,33.35 v64.26,33.27 | T29.2 64.19,41.73 v64.26,41.66 | v61.28,21.27 60.96,21.59 R53.2 55.69,24.45 v54.74,25.4 | IC7.1 53.47,55.47 v53.47,55.5 v53.47,54.36
  other vias: 49.02,36.72 49.02,32.66 49.02,28.59
GND  (via drill 0.33, 0.41, 0.61, 0.81)
  Top 0.305: v59.18,45.59 59.18,45.99 Q1.E | v55.88,45.34 55.88,46.5 Q2.E | IC6.3 31.31,18.99 | Q3.E 58.34,21.76 v59.31,22.73 | 31.31,34.23 C6.2
  Top 0.406: IC5.3 31.31,34.23 | IC4.3 31.31,49.47
  Top 0.508: C4.2 28.64,19.05 IC6.3 | C5.2 30.42,49.47 30.48,49.53 31.25,49.53 31.31,49.47
  Top 0.762: JP1.6 68.58,28.07 69.6,29.08
  Top 0.889: IC6.3 v37.21,19.05 IC6.TAB 44.45,19.05 | IC5.TAB IC5.3 | IC4.TAB IC4.3
  Top 1.016: JP2.36 JP2.35
  Bottom 0.305: 66.19,31.75 66.04,31.75 66.04,30.86 | v65.66,34.29 66.04,34.67 66.04,35.56 | v65.53,37.97 66.04,38.48 66.04,39.37 | v65.66,41.66 66.04,42.04 66.04,43.18
  Bottom 0.406: Q4.E 66.82,26.67 67.31,26.67 | Q8.E 66.1,30.8 66.04,30.86
  Bottom 0.762: JP1.6 69.6,28.96 69.6,29.08
  other vias: 63.63,18.8 46.23,50.67 34.8,18.67 38.48,19.05 29.46,26.29 34.29,24.13 36.83,24.13 35.56,24.13 33.02,28.32 38.61,27.81 39.88,27.81 41.15,27.81 42.42,27.81 43.69,27.81 44.96,27.81 47.5,29.08 47.5,30.35 46.23,27.81 46.23,25.27 44.96,25.27 43.69,25.27 42.42,25.27 41.15,25.27 38.61,25.27 39.88,25.27 39.88,24 38.61,24 38.61,22.73 39.88,22.73 41.15,22.73 42.42,22.73 41.15,24 43.69,24 43.69,22.73 42.42,24 44.96,24 44.96,22.73 46.23,24 46.23,22.73 47.5,24 47.5,22.73 47.5,21.46 47.5,20.19 46.23,21.46 46.23,20.19 47.5,18.92 46.23,18.92 46.23,17.65 47.5,17.65 47.5,16.38 46.23,16.38 46.23,15.11 47.5,15.11 44.96,16.38 44.96,15.11 43.69,15.11 43.69,16.38 42.42,16.38 42.42,15.11 41.15,15.11 39.88,16.38 39.88,15.11 38.61,16.38 38.61,15.11 41.15,16.38 46.23,29.08 44.96,29.08 43.69,29.08 41.15,29.08 42.42,29.08 39.88,29.08 38.61,29.08 38.61,30.35 41.15,30.35 42.42,30.35 39.88,30.35 43.69,30.35 44.96,30.35 46.23,30.35 46.23,31.62 44.96,31.62 44.96,32.89 46.23,32.89 46.23,34.16 44.96,34.16 47.5,31.62 47.5,32.89 47.5,34.16 47.5,36.7 47.5,39.24 46.23,35.43 47.5,35.43 44.96,35.43 46.23,36.7 44.96,36.7 44.96,37.97 46.23,37.97 47.5,37.97 43.69,37.97 42.42,37.97 41.15,37.97 38.61,37.97 39.88,37.97 38.61,39.24 39.88,39.24 41.15,39.24 42.42,39.24 43.69,39.24 44.96,39.24 46.23,39.24 46.23,40.51 44.96,40.51 43.69,40.51 42.42,40.51 41.15,40.51 39.88,40.51 38.61,40.51 39.88,43.05 41.15,43.05 38.61,43.05 42.42,43.05 44.96,43.05 47.5,44.32 46.23,43.05 43.69,43.05 46.23,44.32 44.96,44.32 43.69,44.32 42.42,44.32 41.15,44.32 39.88,44.32 38.61,44.32 38.61,45.59 39.88,45.59 41.15,45.59 42.42,45.59 44.96,45.59 46.23,45.59 43.69,45.59 47.5,45.59 47.5,48.13 47.5,49.4 47.62,50.55 46.23,49.4 44.96,49.4 47.5,51.94 47.5,54.48 47.5,53.21 44.96,50.67 46.23,54.48 44.96,54.48 44.96,53.21 44.96,51.94 46.23,53.21 43.69,53.21 46.23,51.94 44.96,48.13 46.23,48.13 46.23,46.86 44.96,46.86 47.5,46.86 29.46,27.56 65.91,45.34 47.37,3.05 48.64,3.05 49.91,3.05 51.18,3.05 50.67,6.1 48.13,6.1 49.4,6.1 13.46,7.75 56.77,51.94 70.61,9.78 70.61,11.05 70.61,12.32 57.66,12.32 57.66,11.05 57.66,9.78 55.12,15.37 55.12,16.64 55.12,17.91 55.12,19.18 54.61,66.29 55.88,66.29 43.69,54.48 43.69,55.75 44.96,55.75 46.23,55.75 66.67,16.51 72.39,13.46 72.39,30.48 23.62,15.88 38.61,53.21 38.61,54.48 41.15,55.75 39.88,55.75 39.88,54.48 41.15,54.48 41.15,53.21 39.88,53.21 42.42,53.21 42.42,54.48 42.42,55.75 33.78,19.05
  pour Top (rank 6): -3.81,74.93 80.01,74.93 80.01,-2.54 -3.81,-2.54
  pour Bottom (rank 6): -1.27,72.39 80.01,72.39 80.01,-3.81 -1.27,-3.81
  pour Bottom (rank 2, no thermals): 53.34,53.34 60.96,53.34 60.96,45.72 53.34,45.72
  pour Top (rank 2, no thermals): 54.61,20.32 64.77,20.32 64.77,7.62 54.61,7.62
  pour Top (rank 2, no thermals): 46.99,12.7 38.1,12.7 38.1,55.88 46.99,55.88
IR  (via drill 0.41, 0.61)
  Top 0.406: R2.2 R10.2 R4.2 R12.2 R6.2 R14.2 R8.2 R16.2 6.73,62.34 6.73,58.67 v7.75,57.66
  Top 1.143: v27.56,43.31 26.56,44.31 F4.2 | v27.56,44.32 v27.56,43.31 | v27.56,43.31 v27.56,42.29
  Bottom 0.406: v7.75,57.66 8.51,56.9 T8.2
  Bottom 0.889: T3.2 9.78,43.26 9.78,48.51 | 9.78,48.51 10.67,49.4 13.97,49.4 | T5.2 21.97,56.19 21.97,49.78 21.59,49.4 18.03,49.4 | 18.03,49.4 13.97,49.4 | T6.2 18.03,55.8 18.03,49.4 | T7.2 13.97,55.8 13.97,49.4 | T8.2 9.78,55.68 9.78,48.51 | T1.2 19.38,40.69 19.43,40.64
  Bottom 1.143: T4.2 8.2,40.64 10.92,40.64 | 14.86,40.64 10.92,40.64 | 14.86,40.64 19.43,40.64 25.91,40.64 v27.56,42.29 v27.56,44.32 | T3.2 10.87,40.69 10.92,40.64 | T2.2 15.06,40.84 14.86,40.64
N$1  (via drill 0.35)
  Bottom 0.508: R70.1 LED4.A
  other vias: 8.89,7.77
N$2
  Top 0.305: T26.3 62.36,35.31 61.59,34.54 56.52,34.54 55.88,35.18 55.88,43.35 Q2.C 57.15,49.21 R51.1
N$3
  Top 0.889: T26.1 57.39,36.42 X4.2
N$4
  Bottom 0.203: 1_ADJ.2 34.29,25.78 32.77,24.26 32.77,18.03 30.21,15.48 R76.2
N$5
  Top 0.305: Q1.B 64.92,46.82 R50.2
N$6
  Top 0.305: T25.3 61.95,39.65 61.34,40.26 61.34,44.24 Q1.C 61.09,44.75 61.09,47.69 61.91,48.51 R49.1
N$7
  Top 0.889: T25.1 57.34,40.62 X4.1
N$8  (via drill 0.35)
  Top 0.305: D8.A 61.11,62.71 v62.23,61.59
  Bottom 0.305: v62.23,61.59 62.23,55.44 61.09,54.34 R77.1
  other vias: 60.96,54.34
N$9
  Bottom 0.203: 2_ADJ.2 34.29,40.77 34.54,40.51 34.54,31.73 R73.2
N$10  (via drill 0.35)
  Top 0.305: LED2.A 11.43,7.62
  Top 0.508: R68.2 LED2.A
  other vias: 11.43,7.86
N$11
  Top 0.305: Q2.B 58.1,49.59 59.18,50.67 62.61,50.67 63.25,50.04 64.53,50.04 R52.2
N$12
  Top 1.143: IC6.5 28.89,15.65 26.62,17.92 F2.1
N$13  (via drill 0.41)
  Top 0.305: Q3.C 55.88,25.23 55.88,29.21 57.15,30.48 61.47,30.48 | T27.3 61.57,30.48 61.47,30.48 | 61.47,30.48 v61.47,29.97
  Bottom 0.305: R53.1 61.34,26.73 61.34,29.84 v61.47,29.97
N$14  (via drill 0.35)
  Top 0.305: D1.A 67.21,62.71 v67.06,62.87
  Bottom 0.305: R81.1 67.18,66.29 66.55,65.66 66.55,63.37 v67.06,62.87
N$16  (via drill 0.35)
  Top 0.305: v59.69,61.59 59.28,61.59 D7.A | v60.45,55.75 58.99,54.29 R78.1
  Bottom 0.305: v59.69,61.59 59.69,58.8 60.45,58.04 v60.45,55.75
N$17
  Top 0.889: T27.1 57.4,32.23 X4.3
N$18  (via drill 0.35)
  Top 0.305: D10.A 65.28,62.59 65.28,61.21 v66.55,59.94
  Bottom 0.305: v66.55,59.94 66.67,59.82 66.67,56.77 65.66,55.75 65.66,55.74 64.77,54.85 R79.1
  other vias: 64.77,54.34
N$19  (via drill 0.41)
  Top 0.305: v54.74,22.86 55.84,21.76 Q3.B
  Bottom 0.305: v54.74,22.86 56.2,21.4 R54.2
N$20
  Top 1.143: IC5.5 27.04,30.89 F3.1
N$21  (via drill 0.41)
  Top 0.305: v62.99,25.4 62.36,26.04 T28.3
  Bottom 0.305: Q4.C 63.5,26.67 63.5,25.4 | 63.5,25.4 v62.99,25.4 | 63.5,25.4 R55.1
N$22
  Top 1.143: F4.1 28.05,46.13 IC4.5
N$23
  Top 0.889: T28.1 60.25,27.99 X4.4
N$24
  Bottom 0.203: R66.2 32.78,45.21 35.81,45.21 36.7,46.1 36.7,53.98 39.5,56.77 49.53,56.77 3_ADJ.2
N$25  (via drill 0.41)
  Top 0.305: v66.17,24 66.17,25.53 R56.2
  Bottom 0.305: Q4.B 64.77,26.52 64.77,24.77 65.53,24 v66.17,24
N$26  (via drill 0.41)
  Top 0.203: v32.38,47.88 31.42,47.88 IC4.4
  Bottom 0.203: v32.38,47.88 32.38,47.24 30.73,45.59 30.73,43.2 R66.1
N$27
  Bottom 0.305: T29.3 62.84,43.18 Q5.C 64.45,43.67 R57.1
N$28  (via drill 0.41)
  Top 0.203: v33.02,32.51 32.94,32.59 IC5.4
  Bottom 0.203: R73.1 33.02,30.75 v33.02,32.51
N$29
  Bottom 0.889: T29.1 53.97,42.7 X4.5
N$30  (via drill 0.35)
  Top 0.305: D2.A 69.49,62.71 v69.34,62.87
  Bottom 0.305: R82.1 68.98,62.87 v69.34,62.87
N$31  (via drill 0.41)
  Top 0.203: R58.2 67.42,44.18 v67.82,44.58
  Bottom 0.203: Q5.B 67.59,44.58 v67.82,44.58
N$33
  Bottom 0.305: Q6.C 64.84,39.47 T30.3 62.33,39.5 59.69,39.5 59.31,39.12 53.09,39.12 52.64,38.67 R59.1
N$35
  Bottom 0.889: T30.1 59.92,38.1 53.57,38.1 X4.6
N$39  (via drill 0.35)
  Top 0.203: 6.48,7.9 LED3.A
  Top 0.508: R69.2 LED3.A
  Bottom 0.203: R69.2 6.21,8
  other vias: 6.35,7.86
N$40  (via drill 0.35)
  Top 0.305: LED6.A R75.2
  other vias: 20.32,3.41
N$41  (via drill 0.35)
  Top 0.305: LED5.A R72.2
  other vias: 17.78,3.41
N$42  (via drill 0.35)
  Top 0.305: LED1.A R65.2
  other vias: 15.24,3.41
N$44  (via drill 0.36)
  Top 0.203: R1.2 22.23,53.66 v22.23,48.26
  Bottom 0.203: v22.23,48.26 21.59,47.62 21.59,42.44 T1.3
N$45  (via drill 0.35)
  Top 0.305: v64.52,61.34 63.14,62.71 D9.A
  Top 0.508: v62.87,54.47 R80.1
  Bottom 0.305: v64.52,61.34 64.52,58.18 63.66,57.32 63.66,54.89 63.25,54.6 63.11,54.47 v62.87,54.47
N$46
  Top 0.203: R67.1 77.98,24.2 IC1.1
N$47
  Top 0.203: R71.1 77.85,40.69 IC2.1
N$48
  Top 0.203: R74.1 76.2,51.16 76.2,55.45 IC3.1
N$67  (via drill 0.41)
  Top 0.305: R60.2 67.71,40.77 v67.82,40.77
  Bottom 0.305: Q6.B 67.59,40.77 v67.82,40.77
N$78
  Bottom 0.864: X1.1 20.27,44.27 T1.1
N$80  (via drill 0.36)
  Top 0.203: R3.2 18.16,54.67 v18.16,43.18
  Bottom 0.203: v18.16,43.18 17.14,42.16 T2.3
N$81  (1 unrouted)
  Bottom 0.864: X1.2 16.07,44.24 T2.1
N$82  (via drill 0.36)
  Top 0.203: R5.2 13.97,56.2 v13.97,43.18
  Bottom 0.203: v13.97,43.18 13.82,43.18 T3.3
N$83
  Bottom 0.864: X1.3 11.87,44.23 T3.1
N$84  (via drill 0.36)
  Top 0.203: R7.2 9.21,43.75 v8.64,43.18
  Bottom 0.203: v8.64,43.18 8.61,43.16 T4.3
N$85
  Bottom 0.864: X1.4 7.67,44.22 T4.1
N$86
  Bottom 0.203: R9.2 20.83,59.88 20.83,58.4 T5.3
N$87
  Bottom 0.864: T5.1 20.3,52.3 X1.5
N$88
  Bottom 0.203: R11.2 17.53,62.93 17.53,58.29 17.14,57.91 16.03,57.91 T6.3
N$89
  Bottom 0.864: T6.1 15.98,52.37 X1.6
N$90
  Bottom 0.203: R13.2 12.45,62.93 12.45,58.29 11.05,56.9 T7.3
N$91
  Bottom 0.864: T7.1 11.87,54.82 X1.7
N$92
  Bottom 0.203: R15.2 6.63,62.19 T8.3
N$93
  Bottom 0.864: T8.1 7.67,54.79 X1.8
N$94  (via drill 0.41)
  Top 0.203: T9.3 18.41,27.58 18.41,37.85 19.05,38.48 21.72,38.48 23.37,40.13 29.46,40.13 35.18,45.85 v35.18,46.1
  Bottom 0.203: v35.18,46.1 35.18,53.47 39.24,57.53 45.72,57.53 46.74,58.55 46.74,63.28 47.95,64.5 R17.2
N$95
  Top 0.889: T9.1 20.3,31.52 X2.1
N$96  (via drill 0.41)
  Top 0.203: T10.3 14.35,27.33 14.35,38.48 15.37,39.5 20.7,39.5 22.1,40.89 28.7,40.89 33.66,45.85 v33.66,46.1
  Bottom 0.203: R19.2 40.64,64.12 39.42,62.9 39.42,58.73 33.66,52.96 v33.66,46.1
N$97  (1 unrouted)
  Top 0.889: T10.1 16.07,28.8 X2.2
N$98  (via drill 0.41)
  Top 0.203: v22.35,43.18 19.81,40.64 12.45,40.64 10.16,38.35 10.16,27.33 T11.3
  Bottom 0.203: R21.2 34.29,63.23 34.29,56.13 25.27,47.12 25.27,46.1 v22.35,43.18
N$99
  Top 0.889: T11.1 11.79,31.46 X2.3
N$100  (via drill 0.41)
  Top 0.203: v22.35,45.21 19.05,41.91 7.62,41.91 6.35,40.64 6.35,26.95 T12.3
  Bottom 0.203: R23.2 29.21,63.23 29.21,52.07 v22.35,45.21
N$101
  Top 0.889: T12.1 7.59,30.45 7.67,30.53 X2.4
N$102  (via drill 0.41)
  Top 0.203: v35.94,46.74 35.94,45.85 v27.56,37.47
  Bottom 0.203: R25.2 50.53,64.5 49.53,63.5 47.62,63.5 47.24,63.12 47.24,58.55 45.85,57.15 39.37,57.15 35.93,53.71 v35.94,46.74 | v27.56,37.47 27.56,35.15 T13.3
N$103
  Bottom 0.889: T13.1 21.59,33.3 21.59,35.72 X2.5
N$104  (via drill 0.41)
  Top 0.203: v34.42,46.74 34.42,45.85 29.08,40.51 22.73,40.51 21.21,38.99 18.67,38.99 17.78,38.1 17.78,29.46 v17.14,28.83
  Bottom 0.203: R27.2 44.45,63.25 44.45,59.94 42.76,57.91 39.12,57.91 34.42,53.21 v34.42,46.74 | v17.14,28.83 19.05,26.92 T14.3
N$105
  Bottom 0.889: T14.1 18.31,34.8 X2.6
N$106  (via drill 0.41)
  Top 0.203: v22.35,42.16 20.32,40.13 15.11,40.13 13.72,38.73 13.72,29.34 13.08,28.7 v12.95,28.7
  Bottom 0.203: v12.95,28.7 14.73,26.92 T15.3 | R29.2 36.83,63.25 36.83,58.17 25.91,47.24 25.91,45.72 v22.35,42.16
N$107
  Bottom 0.889: T15.1 13.99,34.91 X2.7
N$108  (via drill 0.41)
  Top 0.203: v22.35,44.2 19.3,41.15 12.06,41.15 9.53,38.61 9.53,29.46 v8.89,28.83
  Bottom 0.203: R31.2 31.75,63.34 31.75,54.1 24.8,47.15 24.8,46.65 v22.35,44.2 | v8.89,28.83 8.89,28.32 9.4,27.81 10.41,27.81 10.9,27.33 T16.3
N$109
  Bottom 0.889: T16.1 9.93,34.78 X2.8
N$110  (via drill 0.41)
  Top 0.203: v20.19,12.57 19.33,11.71 T17.3 | v43.18,7.11 R33.2
  Bottom 0.203: v43.18,7.11 40.89,9.4 21.21,9.4 20.45,10.16 20.45,12.32 v20.19,12.57
N$111
  Top 0.889: T17.1 20.3,16.27 X3.1
N$112  (via drill 0.41)
  Top 0.203: v38.1,7.11 R35.2 | v16.13,12.57 16.13,12.55 T18.3
  Bottom 0.203: v38.1,7.11 36.52,8.69 20.9,8.69 18.54,11.05 18.54,11.94 17.91,12.57 v16.13,12.57
N$113
  Top 0.889: T18.1 16.1,16.27 X3.2
N$114  (via drill 0.41)
  Top 0.203: v33.02,7.11 R37.2 | v11.94,12.45 11.05,11.56 T19.3
  Bottom 0.203: v33.02,7.11 32.9,7.11 32.16,7.85 17.68,7.85 14.35,11.18 14.35,12.06 13.72,12.7 12.19,12.7 v11.94,12.45
N$115
  Top 0.889: T19.1 11.87,13.63 X3.3
N$116
  Top 0.203: T20.3 7.14,11.43 9.42,9.14 23.37,9.14 26.42,6.1 27.23,6.1 R39.2
N$117
  Top 0.889: X3.4 7.67,13.54 T20.1
N$118  (via drill 0.33, 0.41)
  Top 0.203: v45.72,7.11 R41.2 | v26.67,6.73 26.67,10.03 v26.04,10.67
  Bottom 0.203: v45.72,7.11 45.59,7.11 44.58,6.1 27.43,6.1 26.8,6.73 v26.67,6.73 | v26.04,10.67 25.02,11.68 T21.3
N$119  (via drill 0.61)
  Top 0.889: X3.5 22.38,19.69 v22.38,16.64 22.35,16.61 v22.35,15.62
  Bottom 0.889: v22.38,16.64 T21.1
N$120  (via drill 0.41)
  Top 0.203: v40.64,7.11 R43.2
  Bottom 0.203: v40.64,7.11 38.71,9.04 21.06,9.04 20.09,10.01 20.09,10.87 T22.3
N$121  (via drill 0.61)
  Top 0.889: X3.6 18.31,19.56 v18.31,16.64 18.29,16.61 v18.29,15.62
  Bottom 0.889: v18.31,16.64 T22.1
N$122  (via drill 0.41)
  Top 0.203: v35.56,7.11 R45.2
  Bottom 0.203: v35.56,7.11 34.46,8.2 17.9,8.2 15.11,10.99 15.11,11.68 T23.3
N$123  (via drill 0.61)
  Top 0.889: X3.7 14.12,19.55 v14.12,16.64 14.1,16.61 v14.1,15.62
  Bottom 0.889: v14.12,16.64 T23.1
N$124  (via drill 0.41)
  Top 0.203: v30.48,7.11 R47.2
  Bottom 0.203: v30.48,7.11 30.48,7.24 30.23,7.49 17.53,7.49 15.62,9.4 12.19,9.4 10.9,10.69 T24.3
N$125  (via drill 0.61)
  Top 0.889: X3.8 9.93,19.54 v9.93,16.64 9.91,16.61 v9.91,15.62
  Bottom 0.889: v9.93,16.64 T24.1
N$127
  Bottom 0.305: 62.48,35.28 T31.3 | 62.48,35.28 64.66,35.28 Q7.C | R61.1 52.89,34.6 53.21,34.92 59.18,34.92 59.56,35.31 62.46,35.31 62.48,35.28
N$128
  Bottom 0.889: T31.1 59.92,33.91 53.58,33.91 X4.7
N$129  (via drill 0.41)
  Top 0.203: R62.2 67.83,37.08 v67.94,37.08
  Bottom 0.305: Q7.B 67.71,37.08 v67.94,37.08
N$130
  Bottom 0.305: Q8.C 64.28,31.09 T32.3 59.03,31.09 58.42,30.48 49.08,30.48 R63.1
N$131
  Bottom 0.889: T32.1 59.84,30.12 59.44,29.72 53.47,29.72 51.86,28.11 X4.8
N$132  (via drill 0.41)
  Top 0.305: v68.71,31.37 67.88,31.37 R64.2
  Bottom 0.305: v68.71,31.37 68.71,32.38 68.39,32.7 Q8.B
OK6_GND
  Top 0.305: IC1.5 JP7.2
OK6_OUT
  Top 0.305: IC1.4 JP7.3
  Bottom 0.305: R85.2 88.66,19.05 JP7.3
OK6_VCC
  Top 0.305: IC1.6 JP7.1
  Bottom 0.305: R85.1 88.66,24.13 JP7.1
OK7_GND
  Top 0.305: IC2.5 JP5.2
OK7_OUT
  Top 0.305: IC2.4 JP5.3
  Bottom 0.305: R84.2 88.66,35.56 JP5.3
OK7_VCC
  Top 0.305: IC2.6 JP5.1
  Bottom 0.305: R84.1 88.66,40.64 JP5.1
OK8_GND
  Top 0.305: IC3.5 JP4.2
OK8_OUT
  Top 0.305: IC3.4 JP4.3
  Bottom 0.305: R83.2 88.66,52.07 JP4.3
OK8_VCC
  Top 0.305: IC3.6 JP4.1
  Bottom 0.305: R83.1 88.66,57.15 JP4.1
PA0
  Top 0.203: R79.2 67.07,52.34 68.07,53.34 69.22,53.34 69.85,53.98 69.85,55.88 JP2.3
PA1  (via drill 0.35)
  Top 0.305: R80.2 62.87,52.32 63.75,51.44 67.31,51.44 67.97,50.77 69.12,50.77 69.88,51.53 69.88,52.86 v70.23,53.21
  Bottom 0.305: JP2.4 73.66,56.64 72.39,55.37 72.39,53.85 71.88,53.34 70.36,53.34 v70.23,53.21
PA2  (via drill 0.35)
  Top 0.203: v67.06,53.34 67.03,53.31 61.88,53.31 R77.2
  Bottom 0.203: v67.06,53.34 69.22,53.34 70.48,54.61 JP2.5
PA3  (via drill 0.35)
  Top 0.305: R78.2 59.47,51.34 59.63,51.18 62.99,51.18 63.5,50.67 v66.04,50.67
  Bottom 0.305: JP2.6 73.66,54.23 72.39,52.96 72.39,51.44 71.75,50.8 69.72,50.8 69.6,50.67 68.07,50.67 67.69,51.05 66.42,51.05 v66.04,50.67
PA4
  Top 0.305: R52.1 68.58,49.53 JP2.7
PA5
  Top 0.305: R50.1 69.85,49.85 69.85,50.04 70.61,50.8 72.39,50.8 JP2.8
PA6
  Top 0.305: R58.1 68.58,43.5 68.58,46.99 JP2.9
PA7
  Top 0.305: R60.1 69.09,40.2 69.09,46.74 70.61,48.26 72.39,48.26 JP2.10
PB0
  Top 0.305: JP2.34 72.39,20.32 JP1.3
PB1
  Top 0.305: JP2.33 67.44,19.05 66.67,19.81 66.67,20.95 JP1.4
PB2
  Bottom 0.305: JP1.2 71.63,17.78 72.39,18.54 72.39,20.32 JP2.32
PB3
  Top 0.305: JP2.31 72.39,22.86 72.39,24.77 71.75,25.4 JP1.5
PB4
  Top 0.203: R14.1 13.97,60.01 JP3.3
  Bottom 0.203: JP3.3 13.65,62.23 R14.1
PB5
  Top 0.203: R8.1 11.43,60.01 11.27,59.85 JP3.2 R7.1
PB6
  Top 0.203: R16.1 8.89,60.01 JP3.1
  Bottom 0.203: JP3.1 8.57,62.23 R16.1
PC0  (via drill 0.35)
  Top 0.203: v78.99,45.2 R71.2
  Bottom 0.203: JP2.18 74.93,39.37 78.99,43.43 v78.99,45.2
PC1  (via drill 0.35)
  Top 0.203: R74.2 78.11,47.51 v79.12,48.53
  Bottom 0.203: JP2.17 72.39,40.64 74.93,40.64 76.2,41.91 76.2,45.61 v79.12,48.53
PC2
  Bottom 0.305: JP2.16 73.79,42.04 74.8,42.04 75.44,42.67 75.44,60.96 70.1,66.29 R81.2
PC3
  Bottom 0.305: JP2.15 71.88,42.67 72.64,42.67 73.15,43.18 74.3,43.18 74.93,43.81 74.93,60.71 71.25,64.39 R82.2
PC4  (via drill 0.35)
  Top 0.305: v62.99,27.86 61.8,27.86 61.34,27.43 61.34,22.99 v59.69,21.34
  Bottom 0.305: JP2.14 72.39,43.18 70.61,43.18 69.72,42.29 69.72,33.91 70.23,33.4 70.23,32.89 69.47,32.13 69.47,30.99 67.94,29.46 65.14,29.46 63.49,27.86 v62.99,27.86 | v59.69,21.34 R54.1
PC5  (via drill 0.35)
  Top 0.305: R56.1 66.17,27.75 66.17,28.7 66.93,29.46 67.94,29.46 69.47,30.99 v69.47,33.15
  Bottom 0.305: JP2.13 69.22,42.55 69.22,33.4 v69.47,33.15
PC6  (via drill 0.35)
  Top 0.305: R64.1 68.01,33.4 v68.45,33.4
  Bottom 0.305: v68.45,33.4 68.71,33.66 68.71,44.07 70.36,45.72 72.39,45.72 JP2.12
PC7
  Top 0.305: R62.1 69.6,36.9 69.6,45.72 70.87,46.99 JP2.11
PD0
  Top 0.305: JP6.1 64.01,59.18 68.07,59.18 J1.4
PD1
  Top 0.305: JP6.2 62.74,57.91 64.14,57.91 64.9,58.67 67.06,58.67 J1.3
PD3  (via drill 0.35)
  Top 0.203: v38.1,61.72 R30.1
  Bottom 0.203: JP6.4 54.61,60.96 54.61,64.77 52.7,66.67 44.07,66.67 42.93,65.53 40.01,65.53 39.24,64.77 39.24,63.88 38.1,62.74 R30.1 v38.1,61.72
PD7  (via drill 0.35)
  Top 0.203: v77.98,33.27 R67.2
  Bottom 0.203: JP2.19 72.39,35.56 75.69,35.56 v77.98,33.27
PE3
  Top 0.203: R2.1 JP8.6 27.94,57.47 R1.1
PE4
  Top 0.305: R22.1 JP8.3
  Bottom 0.305: R22.1 JP8.3
PE5
  Top 0.305: R32.1 JP8.4
  Bottom 0.305: R32.1 JP8.4
PF0
  Top 0.203: JP9.8 R39.1 28.26,8.57 29.21,7.62 29.21,5.9 28.1,4.79 R40.1
PF1
  Top 0.203: JP9.7 R47.1 30.8,8.57 31.75,7.62 31.75,5.9 30.64,4.79 R48.1
PF2
  Top 0.203: JP9.6 R37.1 33.34,8.57 34.29,7.62 34.29,5.9 33.18,4.79 R38.1
PF3
  Top 0.203: JP9.5 R45.1 36.83,7.3 36.83,5.9 35.72,4.79 R46.1
PF4
  Top 0.203: JP9.4 R35.1 39.37,7.3 39.37,5.9 38.26,4.79 R36.1
PF5
  Top 0.203: JP9.3 R43.1 41.91,7.3 41.91,5.9 40.8,4.79 R44.1
PF6
  Top 0.203: JP9.2 R33.1 44.45,7.3 44.45,5.9 43.34,4.79 R34.1
PF7
  Top 0.203: JP9.1 R41.1 46.29,8.57 46.99,7.87 46.99,5.71 46.06,4.79 R42.1
PG5
  Top 0.305: R24.1 JP8.5
  Bottom 0.305: R24.1 JP8.5
PH0  (via drill 0.35)
  Top 0.203: v41.91,62.23 41.64,62.5 R20.1
  Bottom 0.203: JP6.5 53.34,64.77 52.07,66.04 44.45,66.04 43.18,64.77 43.18,63.5 v41.91,62.23 40.64,62.23 R20.1
PH1
  Top 0.305: R26.1 JP6.6
  Bottom 0.305: R26.1 JP6.6
PH3
  Top 0.203: R10.1 JP8.7
  Bottom 0.203: R10.1 JP8.7
PH4
  Top 0.203: R4.1 JP8.8 22.86,57.47 R3.1
PH5
  Top 0.203: R12.1 19.05,60.01 JP3.5
  Bottom 0.203: JP3.5 19.05,60.01 R12.1
PH6
  Top 0.203: R6.1 16.51,60.01 16.35,59.85 | 16.35,59.85 JP3.4 | R5.1 16.35,58.58 16.35,59.85
PJ0
  Top 0.305: R18.1 JP6.7
  Bottom 0.305: R18.1 JP6.7
PJ1
  Top 0.305: R28.1 JP6.8
  Bottom 0.305: R28.1 JP6.8
PL2  (via drill 0.33, 0.35)
  Top 0.203: 30,37.69 v29.97,37.72 29.97,37.69 IC5.1 | v48.39,13.46 48.13,13.21 36.58,13.21 35.69,14.1 35.69,15.81 v35.12,16.38 35.12,16.45 | v23.37,19.63 23.57,19.43 25.66,19.43 26.8,20.57 26.8,22.1 v27.43,22.73 28.7,22.73 29.84,21.59 33.15,21.59 v34.04,20.7 | v13.46,1.78 13.83,1.41 R72.1
  Bottom 0.203: v29.97,37.72 29.97,30.48 30.99,29.46 30.99,25.02 28.96,22.99 27.69,22.99 v27.43,22.73 | v48.39,13.46 49.28,13.46 49.66,13.84 62.23,13.84 66.8,18.41 66.8,20.83 67.56,21.59 69.52,21.59 70.79,22.86 71.5,22.86 72.39,23.75 72.39,25.4 JP2.28 | v23.37,19.63 22.66,18.92 6.86,18.92 4.83,16.89 4.83,4.83 7.62,2.03 13.21,2.03 v13.46,1.78 | v35.12,16.38 35.81,17.08 35.81,19.43 34.54,20.7 v34.04,20.7
  other vias: 17.78,1.41
PL3  (via drill 0.33, 0.35)
  Top 0.203: v33.4,22.35 31.47,22.35 IC6.1 30.45,23.37 6.35,23.37 5.59,22.61 5.59,15.24 v5.46,15.24
  Bottom 0.203: v33.4,22.35 33.53,22.35 36.2,19.68 36.2,14.35 36.96,13.59 47.62,13.59 48.39,14.35 62.1,14.35 66.29,18.54 66.29,23.11 67.31,24.13 69.52,24.13 69.69,24.3 71.12,25.7 JP2.27 | R75.1 20.18,1.41 19.05,2.54 7.87,2.54 5.27,5.14 5.27,15.11 5.4,15.24 v5.46,15.24
PL5  (via drill 0.33, 0.35)
  Top 0.203: v28.19,47.75 28.19,48.01 27.43,48.77 27.43,52.07 28.29,52.93 IC4.1 | v26.8,19.68 27.3,19.18 27.3,18.41 29.21,16.51 32.89,16.51 33.59,15.81 33.59,13.91 v34.29,13.21
  Bottom 0.203: 27.3,23.5 28.7,23.5 30.48,25.27 30.48,29.21 29.08,30.61 29.08,45.85 28.19,46.74 v28.19,47.75 | 27.3,23.5 26.8,22.99 v26.8,19.68 | v34.29,13.21 47.24,13.21 47.62,12.83 49.15,12.83 49.66,13.34 71.12,13.34 72.14,12.32 73.66,12.32 75.31,13.97 75.31,26.92 74.3,27.94 72.39,27.94 JP2.25 | 27.3,23.5 6.6,23.5 5.21,22.1 5.21,17.91 4.32,17.02 4.32,4.57 7.37,1.52 12.45,1.52 12.95,1.02 14.84,1.02 R65.1
UV  (via drill 0.41, 0.61)  (1 unrouted)
  Top 0.406: v15.49,8.38 16,8.38 16.19,8.57 22.92,8.57 25.65,5.84 25.65,3.81 26.61,2.85 R40.2 R48.2 R38.2 R46.2 R36.2 R44.2 R34.2 R42.2
  Top 0.889: T19.2 12.88,10.36 v13.08,10.16 | T18.2 17.07,10.36 v17.27,10.16 | 21.51,10.16 21.26,10.41 T17.2 | v13.97,10.16 13.66,10.24 | 22.86,10.16 v22.23,10.79 v21.59,10.16
  Top 1.143: v21.59,10.16 21.51,10.16 | v21.59,10.16 v18.16,10.16 v17.27,10.16 v13.97,10.16 v13.08,10.16 v10.16,10.16 | v21.59,10.16 22.86,10.16 25.53,12.83 F2.2
  Bottom 0.406: v10.16,10.16 11.43,8.89 15.24,8.89 15.49,8.64 v15.49,8.38
  Bottom 0.889: T24.2 8.97,11.35 v9.4,10.92 v10.16,10.16 | T23.2 13.16,10.24 | 13.16,10.24 v13.08,10.16 | T22.2 17.27,11.61 v17.27,10.16 v18.16,10.16 | T21.2 21.41,11.43 | 21.41,11.43 21.41,10.34 v21.59,10.16 | v22.23,10.79 22.05,10.79 21.41,11.43 | v13.97,10.16 13.16,10.16 13.16,10.24
UV_SET  (via drill 0.41)
  Top 0.203: v33.27,17.27 31.45,17.27 IC6.4
  Bottom 0.203: R76.1 29.23,14.22 30.99,14.22 33.27,16.51 v33.27,17.27
VCC
  Top 0.889: JP1.1 69.72,15.24 70.23,14.73 74.3,14.73 75.31,15.75 75.31,60.83 74.17,61.98 5V.2 74.17,60.2 JP2.2 JP2.1
  Bottom 0.406: J1.2 69.9,55.83 69.9,58.47 JP2.1
WHITE  (via drill 0.41, 0.61)  (1 unrouted)
  Top 0.305: 30.61,64.63 R24.2 | 50.48,64.45 50.8,64.77 R26.2 R18.2 R28.2 R20.2 R30.2 | v37.47,57.78 38.35,57.78 39.37,58.8 39.37,64.39 39.26,64.5 R30.2 | R32.2 R22.2 R30.2
  Top 0.406: R26.2 R32.2 30.75,64.5 30.61,64.63
  Top 0.508: T9.2 21.26,26.34 21.21,26.29
  Top 0.889: 12.7,25.4 9.83,25.4 | 12.7,25.4 v13.21,25.4 16.51,25.4 | v17.4,25.4 16.51,25.4 | T10.2 16.94,25.83 16.51,25.4 | T11.2 12.75,25.45 12.7,25.4 | v23.5,26.29 v22.48,26.29
  Top 1.143: v23.5,26.29 21.21,26.29 20.32,25.4 9.83,25.4 T12.2 | v22.48,26.29 25.8,26.29 F3.2
  Bottom 0.305: v37.47,57.78 37.08,57.78 26.8,47.5 26.8,46.4 28.5,44.7 28.5,34.29 25.17,30.96 25.17,30.71 24.54,30.07 24.47,30.14
  Bottom 0.889: T16.2 8.97,26.47 v9.14,26.29 v9.91,25.53 | T15.2 12.7,26.59 v12.7,26.29 12.7,25.91 v13.21,25.4 | T14.2 16.89,26.47 v16.89,26.29 16.89,25.91 v17.4,25.4 | T13.2 24.47,30.14 22.48,28.14 v22.48,26.29 v23.5,26.29

### Text on the board
tPlace: 6 | REV B | 5 | 4 | Cathode / Channel 3 | Anode | 3 | Cathode / Channel 2 | 2 | Cathode / Channel 1 | CUT | 1 | 10k*18 | A | B | C | D | E | F | G | H
tNames: 4.1kVAC-RMS ISOLATION | 3x8x8 1A OUTPUT LED MATRIX DRIVER | 32 / 16 / 8 / 4 / 2 / 1 | H11L1SR2M*3 | 3-15V / GND / Out 3 / / / / 3-15V / GND / Out 2 / / / / 3-15V / GND / Out 1 | G 5V SDA SCL | 5v,MO,SS,SCK,MI,GND | Nicholas Steele / 3x8x8 1A LED Driver - Arduino MEGA 2560 Shield | POWER | FSE / 5v / VIN | 1 / 2 / 3\ | OUTPUT | 5V OR 7-25V 4A (MAX V IS LOWEST LED FORWARD V + 5)
tValues: 1.1A | 1.1A | 1.1A | 1.1A